# EAGLE design Bidirectional_Amp (EAGLE 9.3.0)

## Sheet 1 of 7: WiFi Adapter Interface and TX/RX Control
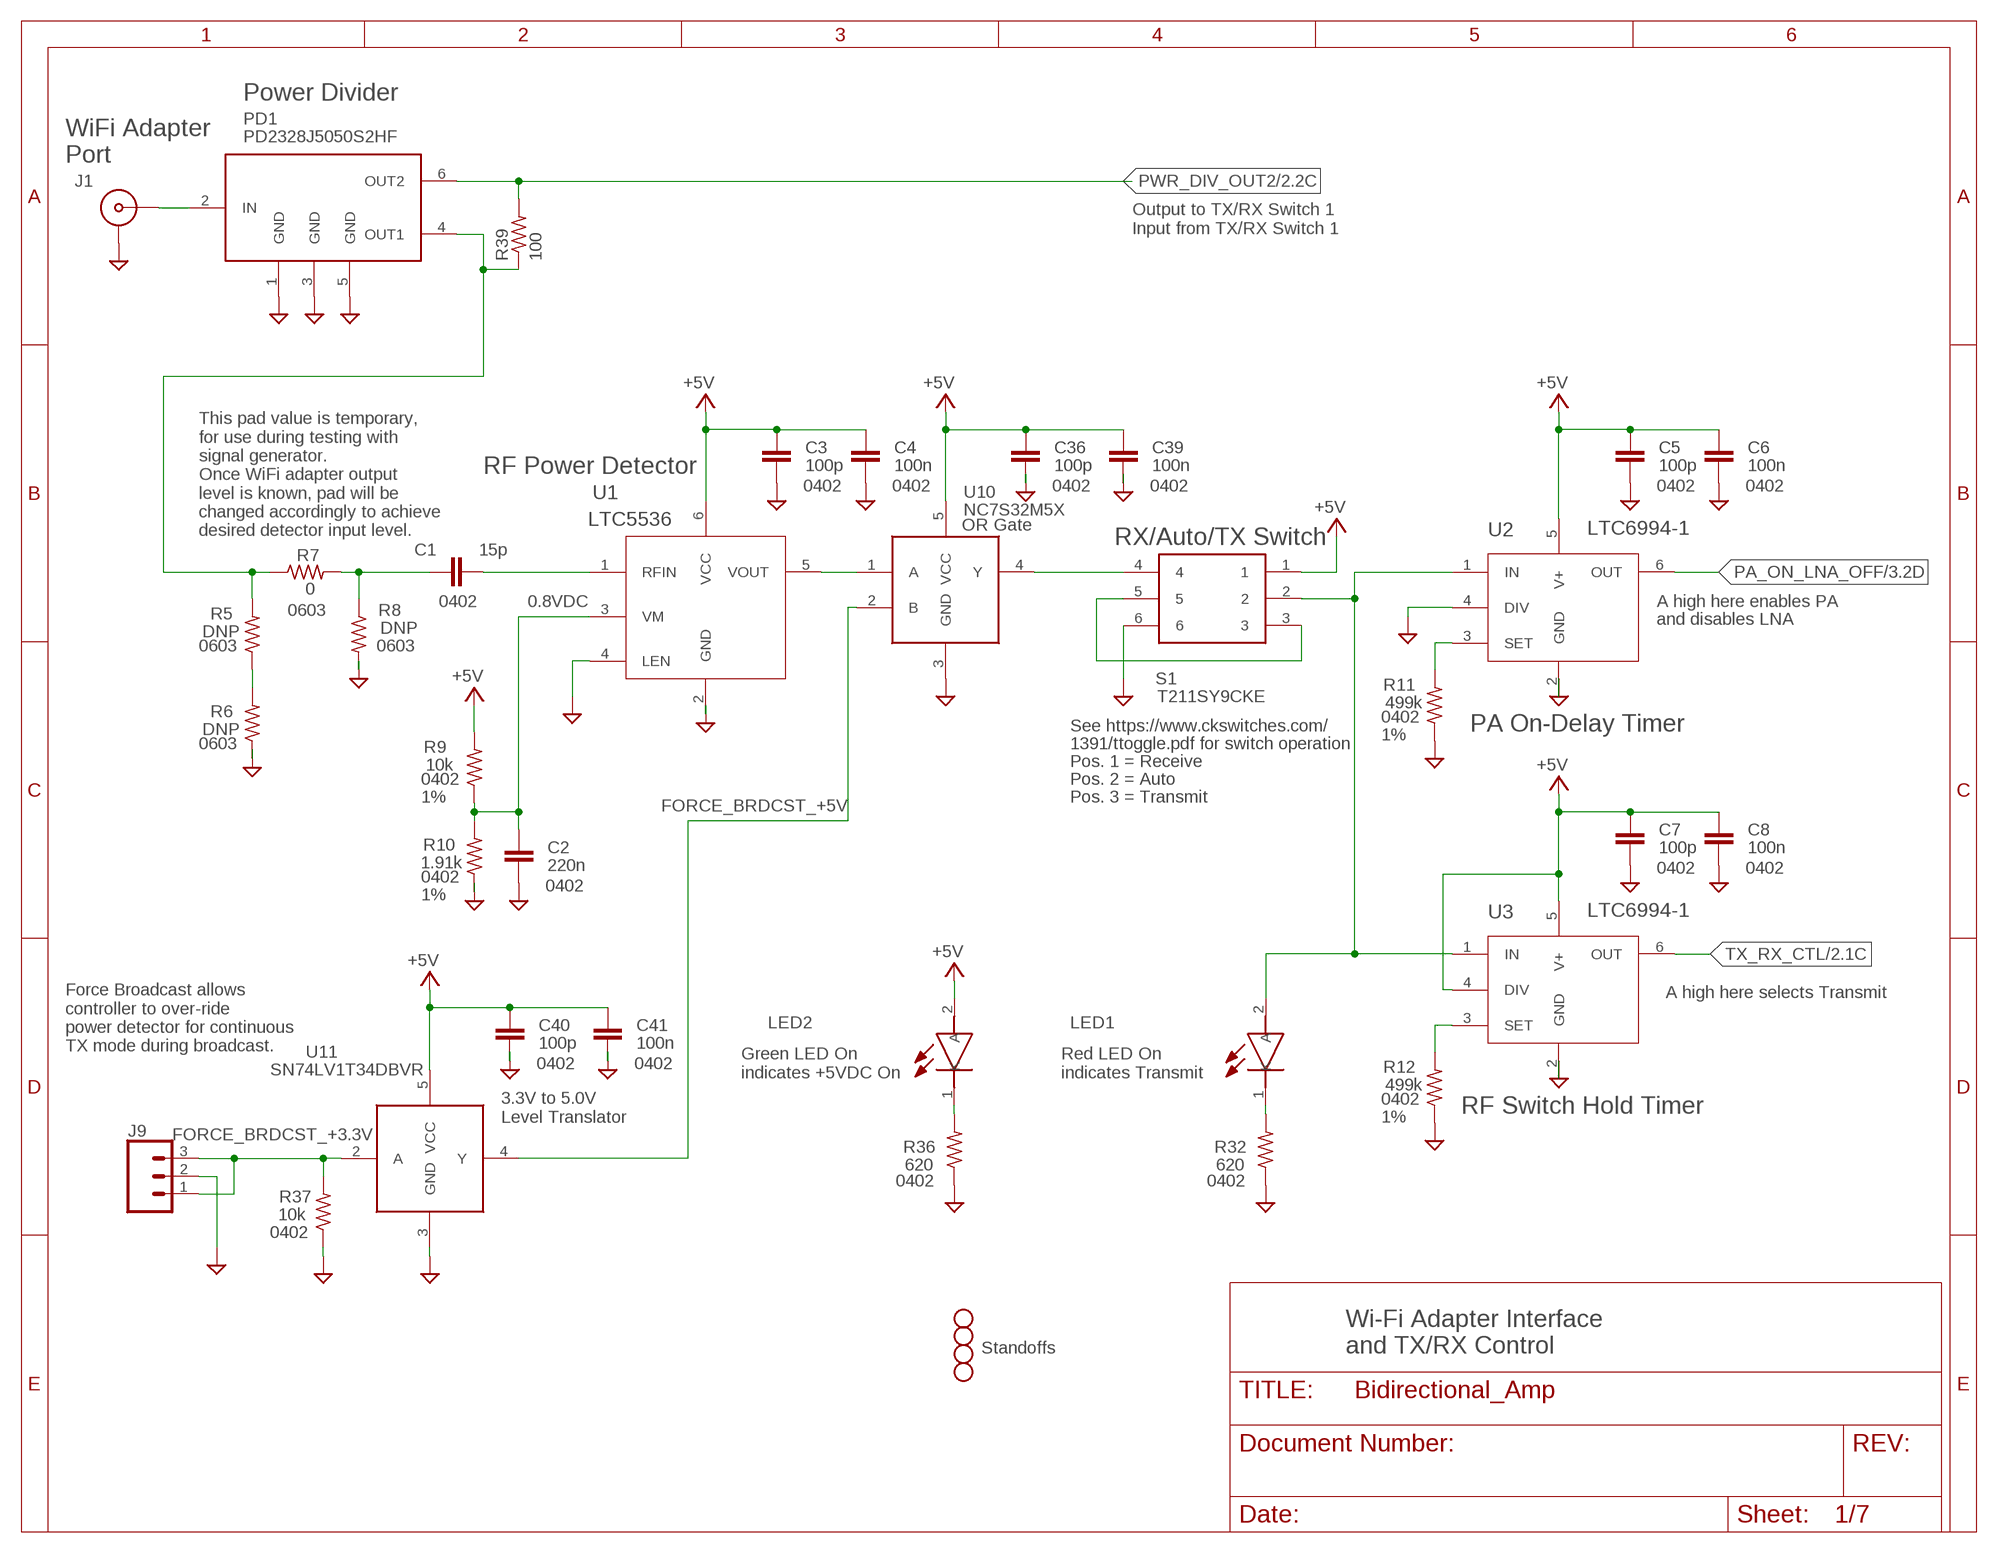
[diagram p0: schematic, sheet 1]

### Parts
C1  15p  C-EU0402-B-NOSILK  [.0402-B-NOSILK]
C2  220n  C-EU0402-B-NOSILK  [.0402-B-NOSILK]
C3  100p  C-EU0402-B-NOSILK  [.0402-B-NOSILK]
C4  100n  C-EU0402-B-NOSILK  [.0402-B-NOSILK]
C5  100p  C-EU0402-B-NOSILK  [.0402-B-NOSILK]
C6  100n  C-EU0402-B-NOSILK  [.0402-B-NOSILK]
C7  100p  C-EU0402-B-NOSILK  [.0402-B-NOSILK]
C8  100n  C-EU0402-B-NOSILK  [.0402-B-NOSILK]
C36  100p  C-EU0402-B-NOSILK  [.0402-B-NOSILK]
C39  100n  C-EU0402-B-NOSILK  [.0402-B-NOSILK]
C40  100p  C-EU0402-B-NOSILK  [.0402-B-NOSILK]
C41  100n  C-EU0402-B-NOSILK  [.0402-B-NOSILK]
H1  STAND-OFFTIGHT  [STAND-OFF-TIGHT]
H2  STAND-OFFTIGHT  [STAND-OFF-TIGHT]
H3  STAND-OFFTIGHT  [STAND-OFF-TIGHT]
H4  STAND-OFFTIGHT  [STAND-OFF-TIGHT]
J1  73415-2061  [73415-2063]
J9  CONN_03LONGPADS  [1X03_LONGPADS]
LED1  LTST-C193KRKT-5A  [LEDC1607X80N]
LED2  LTST-C193KGKT-5A  [LEDC1607X80N]
PD1  PD2328J5050S2HF  [PSON65P204X129X58-6N]
R5  DNP  R-US_R0603  [R0603]
R6  DNP  R-US_R0603  [R0603]
R7  0  R-US_R0603  [R0603]
R8  DNP  R-US_R0603  [R0603]
R9  10k  R-US_0402-B-NOSILK  [.0402-B-NOSILK]
R10  1.91k  R-US_0402-B-NOSILK  [.0402-B-NOSILK]
R11  499k  R-US_0402-B-NOSILK  [.0402-B-NOSILK]
R12  499k  R-US_0402-B-NOSILK  [.0402-B-NOSILK]
R32  620  R-US_0402-B-NOSILK  [.0402-B-NOSILK]
R36  620  R-US_0402-B-NOSILK  [.0402-B-NOSILK]
R37  10k  R-US_0402-B-NOSILK  [.0402-B-NOSILK]
R39  100  R-US_0603-C-NOSILK  [.0603-C-NOSILK]
S1  T211SY9CKE  T201MH9V3BE  [T201MH9V3BE]
U1  LTC5536  LTC5536ES6TRMPBF  [TSOT-23_S6]
U2  LTC6994-1  LTC6994CS6-1PBF  [TSOT-23_S6]
U3  LTC6994-1  LTC6994CS6-1PBF  [TSOT-23_S6]
U10  NC7S32M5X  [SOT95P280X145-5N]
U11  SN74LV1T34DBVR  [SOT95P280X145-5N]

### Nets
+5V: C3.1 C4.1 C5.1 C6.1 C7.1 C8.1 C36.1 C39.1 C40.1 C41.1 LED2.2(A) R9.2 S1.1 U1.6(VCC) U2.5(V+) U3.4(DIV) U3.5(V+) U10.5(VCC) U11.5(VCC) ; also sheet 2,3,4,5,6
FORCE_BRDCST_+3.3V: J9.1 J9.3 R37.2 U11.2(A)
FORCE_BRDCST_+5V: U10.2(B) U11.4(Y)
GND: C2.2 C3.2 C4.2 C5.2 C6.2 C7.2 C8.2 C36.2 C39.2 C40.2 C41.2 J1.2(GND) J1.3(GND) J1.4(GND) J1.5(GND) J9.2 PD1.1(GND) PD1.3(GND) PD1.5(GND) R6.1 R8.2 R10.1 R11.1 R12.1 R32.1 R36.1 R37.1 S1.6 U1.2(GND) U1.4(LEN) U2.2(GND) U2.4(DIV) U3.2(GND) U10.3(GND) U11.3(GND) ; also sheet 2,3,4,5,6,7
N$1 [RF]: J1.1(CTR) PD1.2(IN)
N$3: U1.5(VOUT) U10.1(A)
N$5 [RF]: PD1.4(OUT1) R5.2 R7.1 R39.1
N$6 [RF]: C1.1 R7.2 R8.1
N$7: R5.1 R6.2
N$8 [RF]: C1.2 U1.1(RFIN)
N$9: C2.1 R9.1 R10.2 U1.3(VM)
N$10: LED1.2(A) S1.2 U2.1(IN) U3.1(IN)
N$11: R11.2 U2.3(SET)
N$12: S1.3 S1.5
N$14: R12.2 U3.3(SET)
N$15: LED1.1(K) R32.2
N$51: LED2.1(K) R36.2
N$52: S1.4 U10.4(Y)
PA_ON_LNA_OFF: U2.6(OUT) ; also sheet 3,4
PWR_DIV_OUT2 [RF]: PD1.6(OUT2) R39.2 ; also sheet 2
TX_RX_CTL: U3.6(OUT) ; also sheet 2,5

### Notes on the sheet
- Power Divider
- WiFi Adapter
  Port
- Output to TX/RX Switch 1
  Input from TX/RX Switch 1
- RF Power Detector
- 0402 | 0402 | 0402 | 0402 | 0402 | 0402
- OR Gate
- This pad value is temporary,
  for use during testing with
  signal generator.
  Once WiFi adapter output
  level is known, pad will be
  changed accordingly to achieve
  desired detector input level.
- RX/Auto/TX Switch
- 0402 | 0.8VDC | A high here enables PA
- 0603
- and disables LNA
- 0603 | 0603
- 0402
- See https://www.ckswitches.com/ | PA On-Delay Timer
- 1%
- 0603 | 1391/ttoggle.pdf for switch operation
- Pos. 1 = Receive
- 0402 | Pos. 2 = Auto
- 1% | Pos. 3 = Transmit
- 0402 | 0402
- 0402
- 0402
- 1%
- A high here selects Transmit
- Force Broadcast allows
  controller to over-ride
  power detector for continuous
  TX mode during broadcast.
- 0402 | 0402
- Green LED On
  indicates +5VDC On
- Red LED On
  indicates Transmit
- 0402
- RF Switch Hold Timer
- 3.3V to 5.0V
  Level Translator
- 1%
- 0402 | 0402
- 0402
- Standoffs
- Wi-Fi Adapter Interface
  and TX/RX Control

## Sheet 2 of 7: TX/RX Switching, WiFi Adapter Side
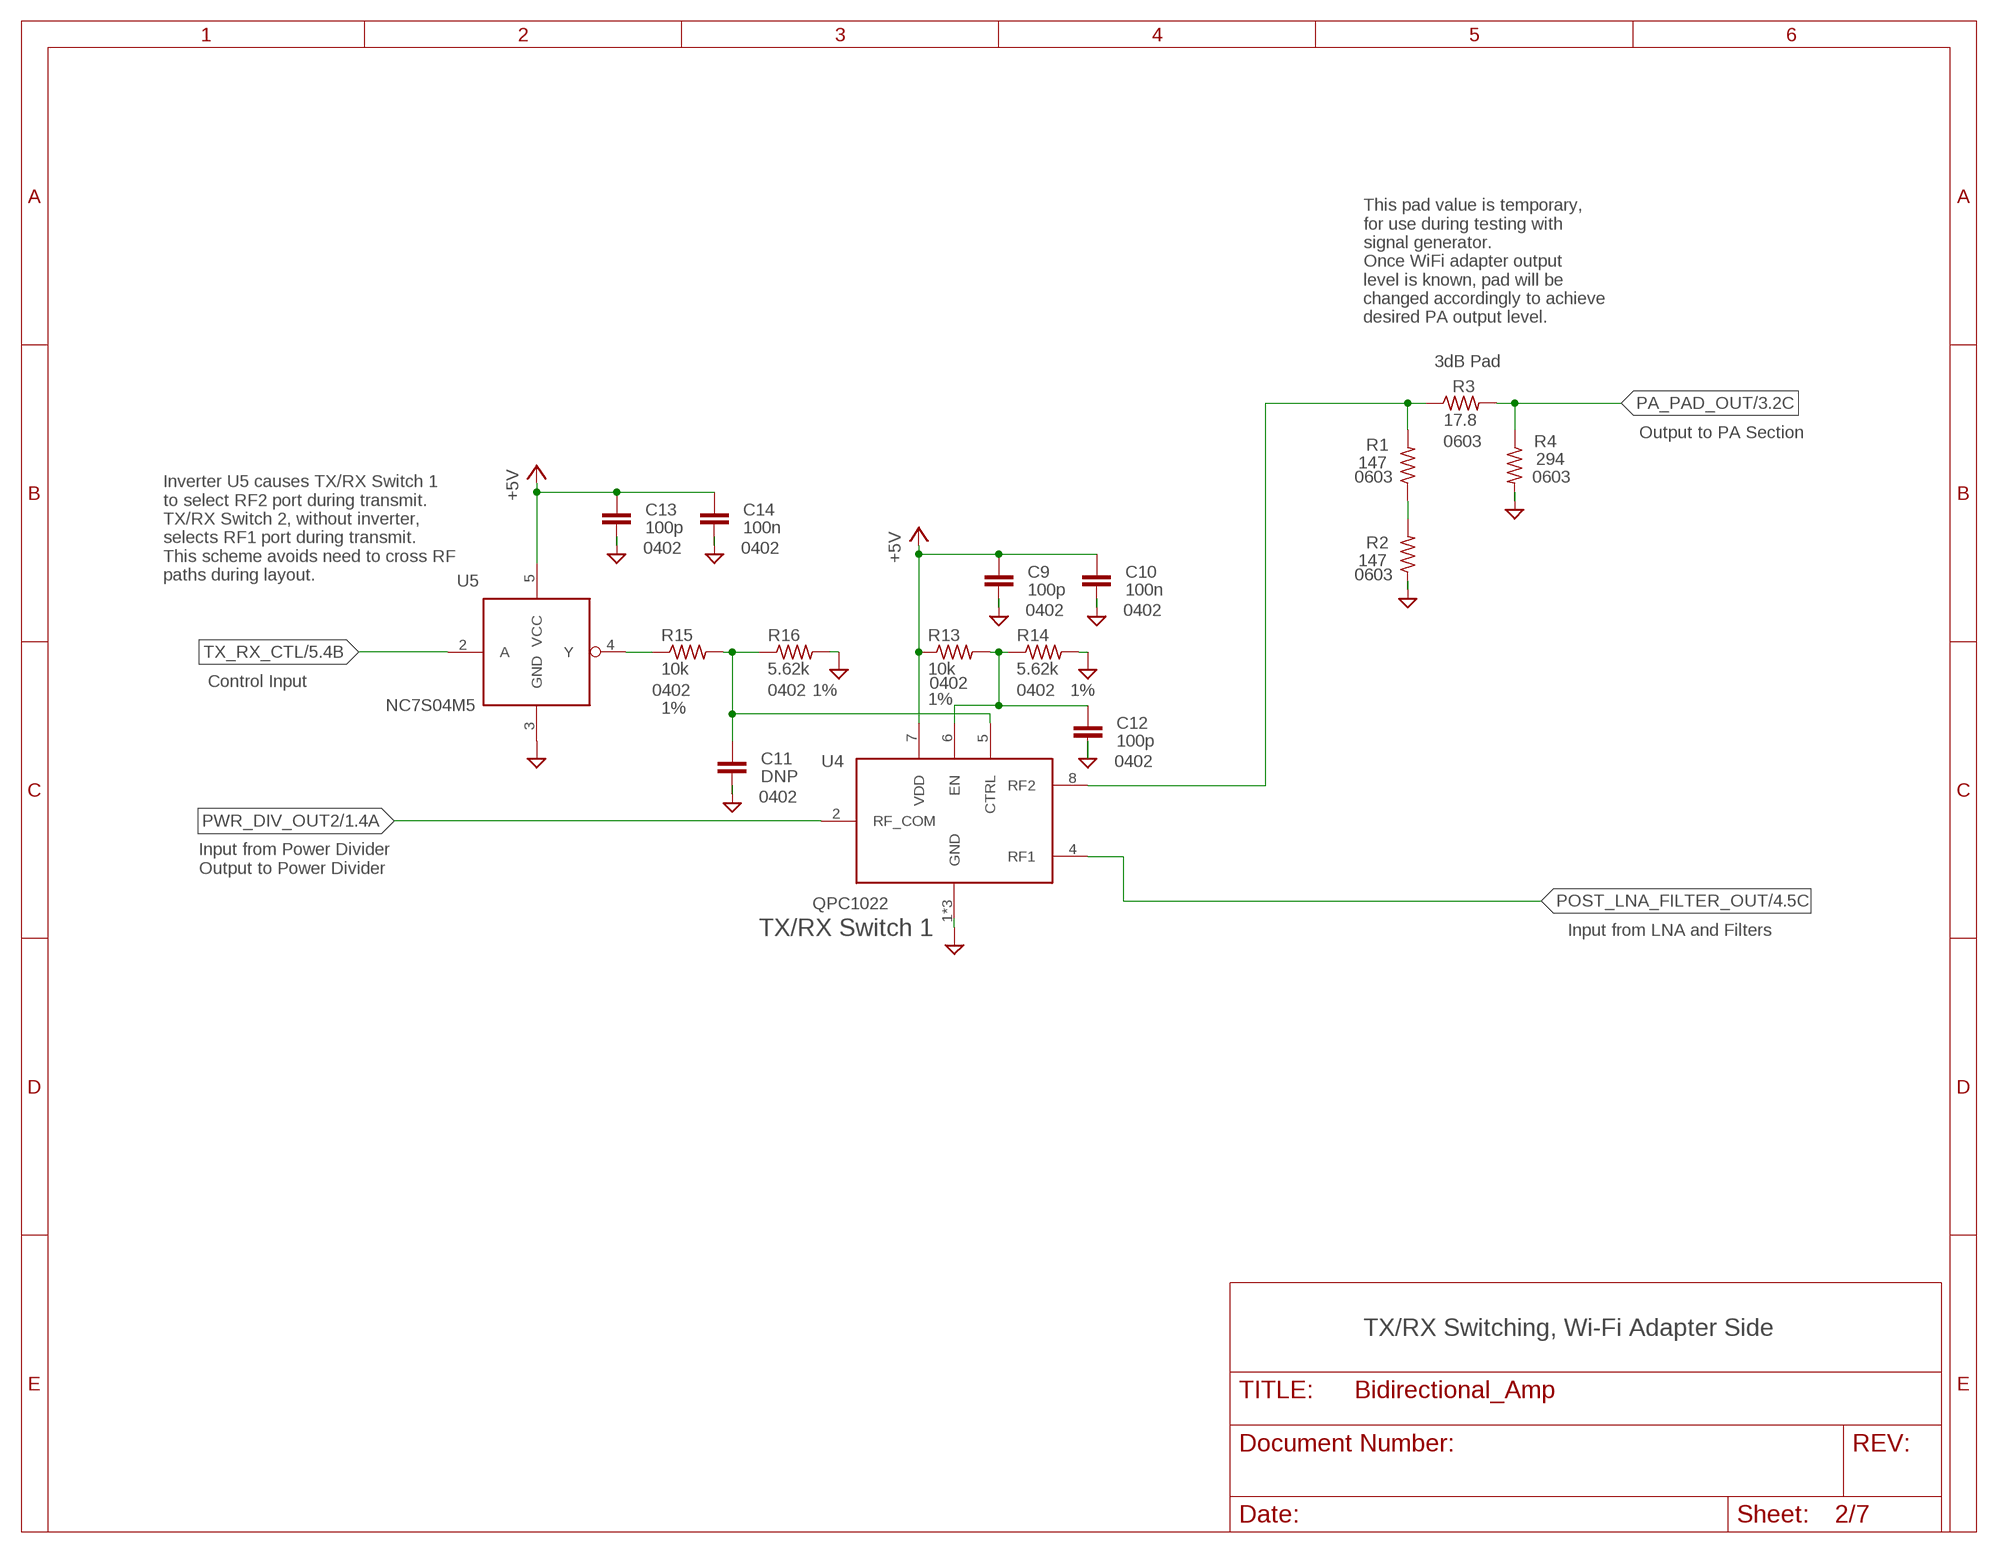
[diagram p1: schematic, sheet 2]

### Parts
C9  100p  C-EU0402-B-NOSILK  [.0402-B-NOSILK]
C10  100n  C-EU0402-B-NOSILK  [.0402-B-NOSILK]
C11  DNP  C-EU0402-B-NOSILK  [.0402-B-NOSILK]
C12  100p  C-EU0402-B-NOSILK  [.0402-B-NOSILK]
C13  100p  C-EU0402-B-NOSILK  [.0402-B-NOSILK]
C14  100n  C-EU0402-B-NOSILK  [.0402-B-NOSILK]
R1  147  R-US_R0603  [R0603]
R2  147  R-US_R0603  [R0603]
R3  17.8  R-US_R0603  [R0603]
R4  294  R-US_R0603  [R0603]
R13  10k  R-US_0402-B-NOSILK  [.0402-B-NOSILK]
R14  5.62k  R-US_0402-B-NOSILK  [.0402-B-NOSILK]
R15  10k  R-US_0402-B-NOSILK  [.0402-B-NOSILK]
R16  5.62k  R-US_0402-B-NOSILK  [.0402-B-NOSILK]
U4  QPC1022  [QPC1022]
U5  NC7S04M5  NC7S04M5XX  [SOT95P280X140-5N]

### Nets
+5V: C9.1 C10.1 C13.1 C14.1 R13.1 U4.7(VDD) U5.5(VCC) ; also sheet 1,3,4,5,6
GND: C9.2 C10.2 C11.2 C12.2 C13.2 C14.2 R2.1 R4.2 R14.2 R16.2 U4.1(GND) U4.3(GND) U4.9(GND) U5.3(GND) ; also sheet 1,3,4,5,6,7
N$2 [RF]: R1.2 R3.1 U4.8(RF2)
N$4: R1.1 R2.2
N$13: C12.1 R13.2 R14.1 U4.6(EN)
N$17: C11.1 R15.2 R16.1 U4.5(CTRL)
N$18: R15.1 U5.4(Y)
PA_PAD_OUT [RF]: R3.2 R4.1 ; also sheet 3
POST_LNA_FILTER_OUT [RF]: U4.4(RF1) ; also sheet 4
PWR_DIV_OUT2 [RF]: U4.2(RF_COM) ; also sheet 1
TX_RX_CTL: U5.2(A) ; also sheet 1,5

### Notes on the sheet
- This pad value is temporary,
  for use during testing with
  signal generator.
  Once WiFi adapter output
  level is known, pad will be
  changed accordingly to achieve
  desired PA output level.
- 3dB Pad
- Output to PA Section
- 0603
- 0603 | 0603
- 0402 | 0402
- Inverter U5 causes TX/RX Switch 1
  to select RF2 port during transmit.
  TX/RX Switch 2, without inverter,
  selects RF1 port during transmit.
  This scheme avoids need to cross RF
  paths during layout.
- 0603
- 0402 | 0402
- Control Input | 0402
- 0402 | 0402 | 1% | 0402 | 1%
- 1%
- 1%
- 0402
- 0402
- Input from Power Divider
  Output to Power Divider
- TX/RX Switch 1 | Input from LNA and Filters
- TX/RX Switching, Wi-Fi Adapter Side

## Sheet 3 of 7: Power Amplifier
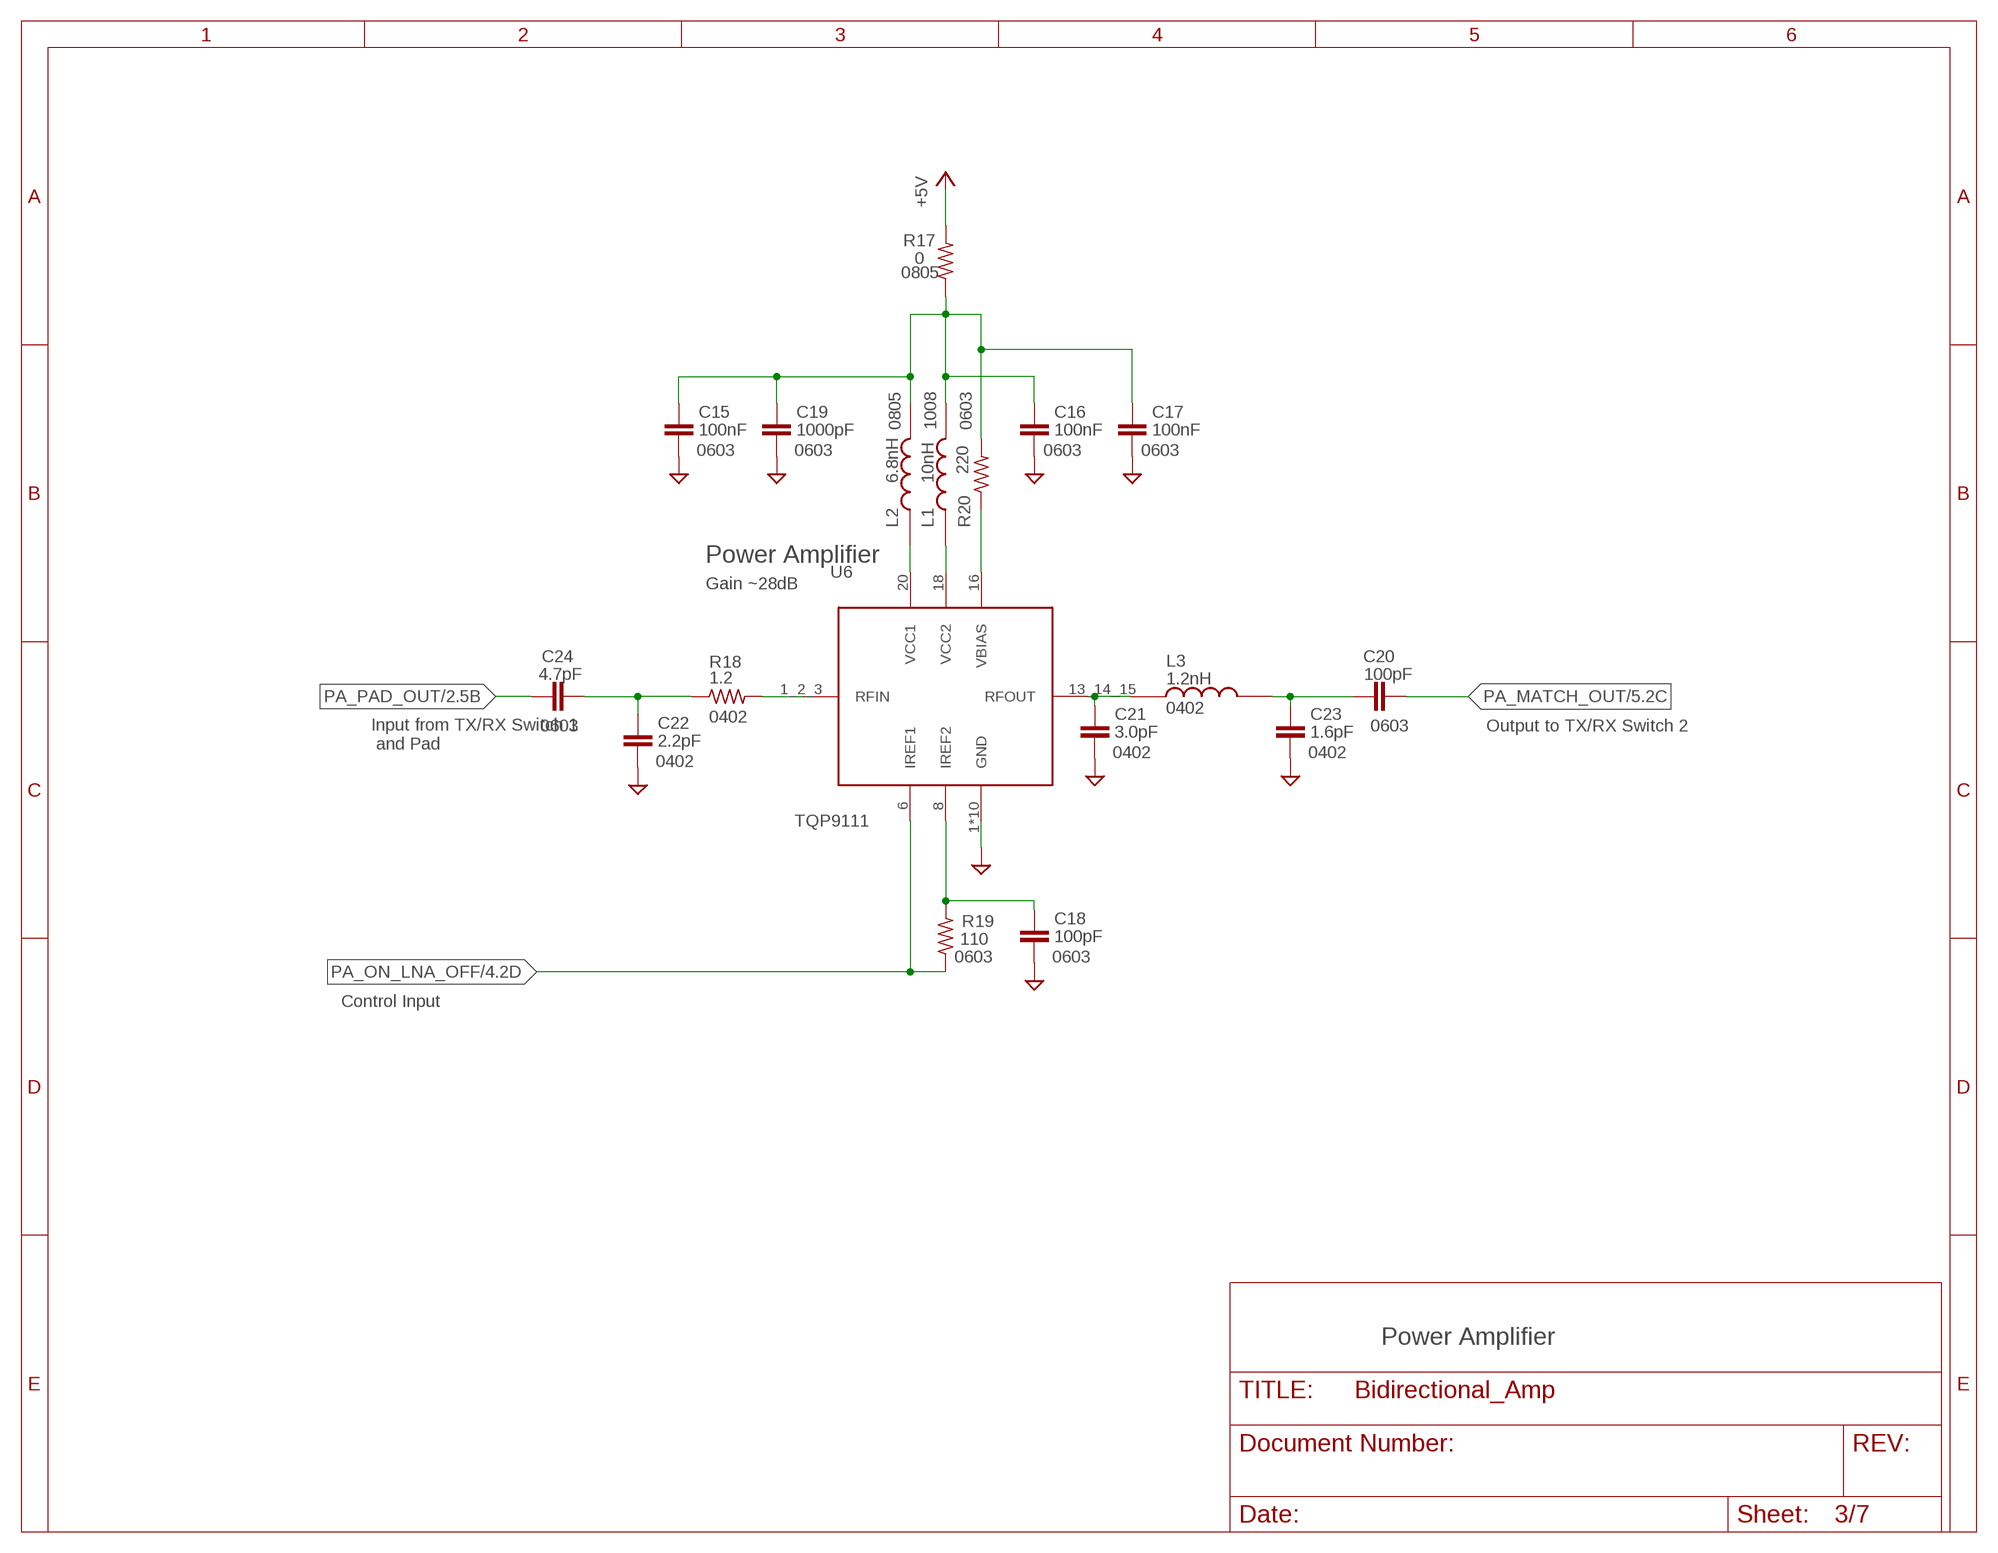
[diagram p2: schematic, sheet 3]

### Parts
C15  100nF  C-EUC0603  [C0603]
C16  100nF  C-EUC0603  [C0603]
C17  100nF  C-EUC0603  [C0603]
C18  100pF  C-EUC0603  [C0603]
C19  1000pF  C-EUC0603  [C0603]
C20  100pF  C-EUC0603  [C0603]
C21  3.0pF  C-EUC0402  [C0402]
C22  2.2pF  C-EUC0402  [C0402]
C23  1.6pF  C-EUC0402  [C0402]
C24  4.7pF  C-EUC0603  [C0603]
L1  10nH  1008HQ-10NXJLB  [INDC2928X203N]
L2  6.8nH  0805CS-060XJLC  [0805CS]
L3  1.2nH  0402CS-1N2XJLW  [0402CS1N2XJLW]
R17  0  R-US_R0805  [R0805]
R18  1.2  R-US_R0402  [R0402]
R19  110  R-US_R0603  [R0603]
R20  220  R-US_R0603  [R0603]
U6  TQP9111  [SAMACSYS_PARTS_QFN50P400X400X102-21N]

### Nets
+5V: R17.2 ; also sheet 1,2,4,5,6
GND: C15.2 C16.2 C17.2 C18.2 C19.2 C21.2 C22.2 C23.2 U6.1(GND) U6.5(GND) U6.7(GND) U6.9(GND) U6.10(GND) U6.11(GND) U6.15(GND) U6.17(GND) U6.19(GND) U6.21(GND) ; also sheet 1,2,4,5,6,7
N$16: R20.1 U6.16(VBIAS)
N$19: L1.1 U6.18(VCC2)
N$20: L2.1 U6.20(VCC1)
N$21: C15.1 C16.1 C17.1 C19.1 L1.2 L2.2 R17.1 R20.2
N$22: C18.1 R19.2 U6.8(IREF2)
N$24 [RF]: C21.1 L3.1 U6.13_14_15(RFOUT)
N$25 [RF]: C22.1 C24.2 R18.1
N$27 [RF]: C20.1 C23.1 L3.2
N$56 [RF]: R18.2 U6.1_2_3(RFIN)
PA_MATCH_OUT [RF]: C20.2 ; also sheet 5
PA_ON_LNA_OFF: R19.1 U6.6(IREF1) ; also sheet 1,4
PA_PAD_OUT [RF]: C24.1 ; also sheet 2

### Notes on the sheet
- 0805
- 0805 | 1008 | 0603
- 0603 | 0603 | 0603 | 0603
- Power Amplifier
- Gain ~28dB
- 0402
- 0402
- 0603 | 0603 | Output to TX/RX Switch 2
- Input from TX/RX Switch 1
   and Pad
- 0402 | 0402
- 0402
- 0603 | 0603
- Control Input
- Power Amplifier

## Sheet 4 of 7: LNA and RX Bandpass Filters
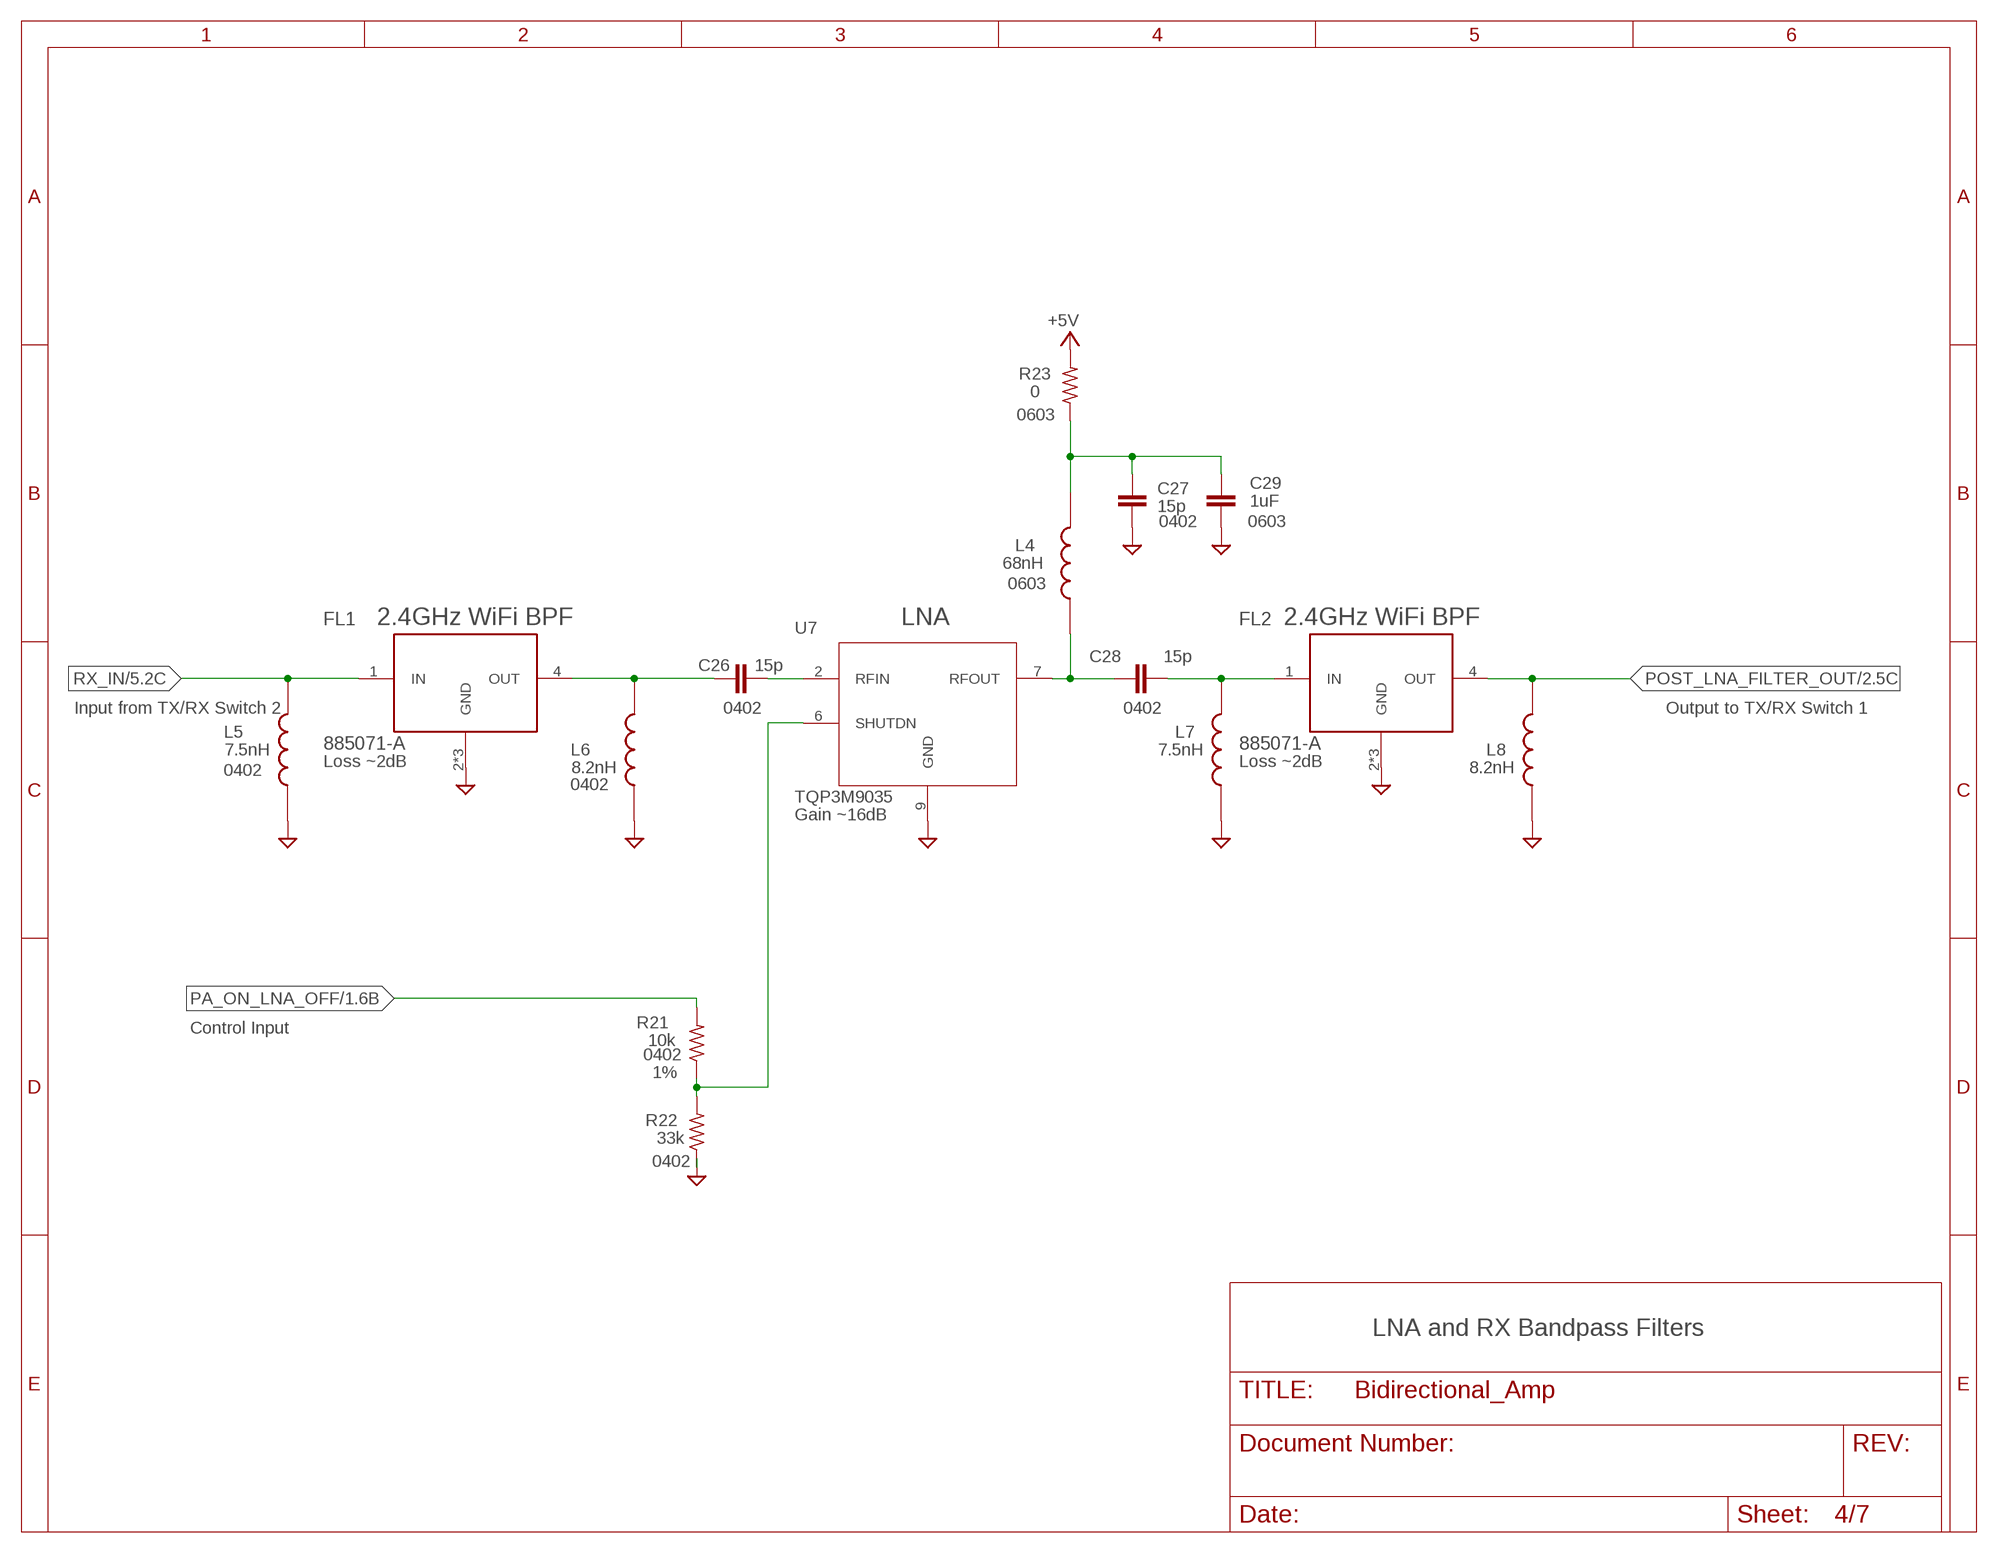
[diagram p3: schematic, sheet 4]

### Parts
C26  15p  C-EUC0402  [C0402]
C27  15p  C-EU0402-B-NOSILK  [.0402-B-NOSILK]
C28  15p  C-EUC0402  [C0402]
C29  1uF  C-EUC0603  [C0603]
FL1  885071-A  [FIL_B39162B9417K610]
FL2  885071-A  [FIL_B39162B9417K610]
L4  68nH  0603CS-68NXJLW  [0603CS-68NXJLW]
L5  7.5nH  0402CS-1N2XJLW  [0402CS1N2XJLW]
L6  8.2nH  0402CS-1N2XJLW  [0402CS1N2XJLW]
L7  7.5nH  0402CS-1N2XJLW  [0402CS1N2XJLW]
L8  8.2nH  0402CS-1N2XJLW  [0402CS1N2XJLW]
R21  10k  R-US_0402-B-NOSILK  [.0402-B-NOSILK]
R22  33k  R-US_0402-B-NOSILK  [.0402-B-NOSILK]
R23  0  R-US_R0603  [R0603]
U7  TQP3M9035  [DFN-8]

### Nets
+5V: R23.2 ; also sheet 1,2,3,5,6
GND: C27.1 C29.2 FL1.2(GND) FL1.3(GND) FL1.5(GND) FL2.2(GND) FL2.3(GND) FL2.5(GND) L5.1 L6.1 L7.1 L8.1 R22.1 U7.9(GND) ; also sheet 1,2,3,5,6,7
N$26 [RF]: C26.2 U7.2(RFIN)
N$28 [RF]: C28.1 L4.1 U7.7(RFOUT)
N$29: C27.2 C29.1 L4.2 R23.1
N$30: R21.1 R22.2 U7.6(SHUTDN)
N$33 [RF]: C26.1 FL1.4(OUT) L6.2
N$35 [RF]: C28.2 FL2.1(IN) L7.2
PA_ON_LNA_OFF: R21.2 ; also sheet 1,3
POST_LNA_FILTER_OUT [RF]: FL2.4(OUT) L8.2 ; also sheet 2
RX_IN [RF]: FL1.1(IN) L5.2 ; also sheet 5

### Notes on the sheet
- 0603
- 0402 | 0603
- 0603
- 2.4GHz WiFi BPF | LNA | 2.4GHz WiFi BPF
- Input from TX/RX Switch 2 | 0402 | 0402 | Output to TX/RX Switch 1
- Loss ~2dB | Loss ~2dB
- 0402
- 0402
- Gain ~16dB
- Control Input
- 0402
- 1%
- 0402
- LNA and RX Bandpass Filters

## Sheet 5 of 7: TX/RX Switching, Antenna Side
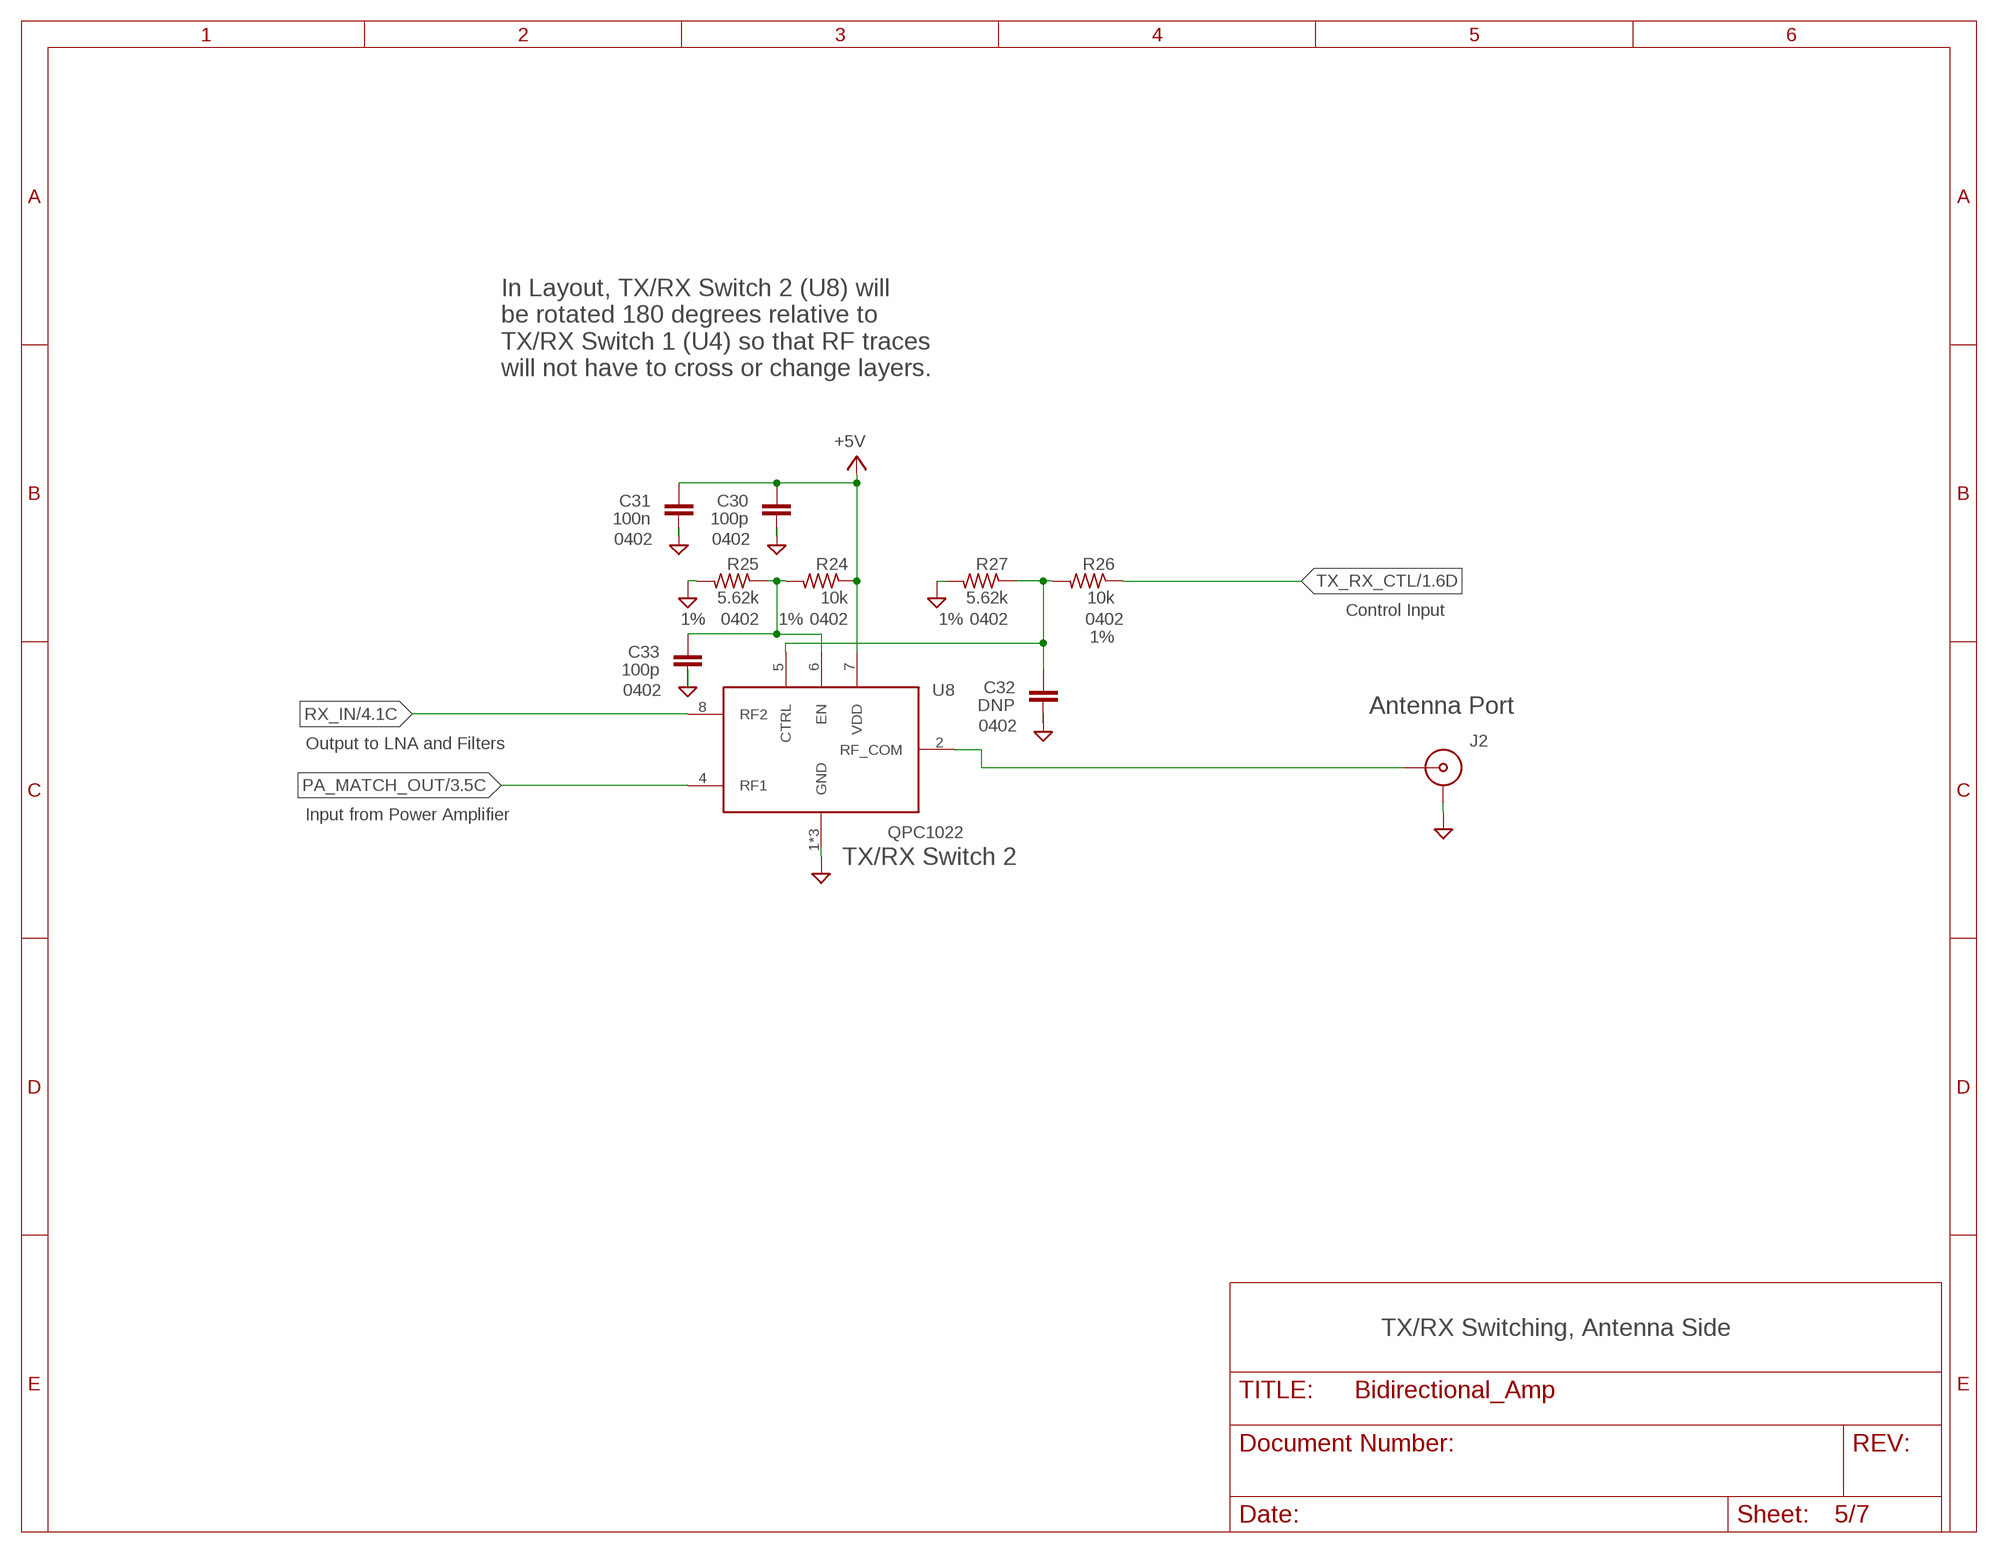
[diagram p4: schematic, sheet 5]

### Parts
C30  100p  C-EU0402-B-NOSILK  [.0402-B-NOSILK]
C31  100n  C-EU0402-B-NOSILK  [.0402-B-NOSILK]
C32  DNP  C-EU0402-B-NOSILK  [.0402-B-NOSILK]
C33  100p  C-EU0402-B-NOSILK  [.0402-B-NOSILK]
J2  73415-2061  [73415-2063]
R24  10k  R-US_0402-B-NOSILK  [.0402-B-NOSILK]
R25  5.62k  R-US_0402-B-NOSILK  [.0402-B-NOSILK]
R26  10k  R-US_0402-B-NOSILK  [.0402-B-NOSILK]
R27  5.62k  R-US_0402-B-NOSILK  [.0402-B-NOSILK]
U8  QPC1022  [QPC1022]

### Nets
+5V: C30.1 C31.1 R24.1 U8.7(VDD) ; also sheet 1,2,3,4,6
GND: C30.2 C31.2 C32.2 C33.2 J2.2(GND) J2.3(GND) J2.4(GND) J2.5(GND) R25.2 R27.2 U8.1(GND) U8.3(GND) U8.9(GND) ; also sheet 1,2,3,4,6,7
N$31 [RF]: J2.1(CTR) U8.2(RF_COM)
N$32: C33.1 R24.2 R25.1 U8.6(EN)
N$34: C32.1 R26.2 R27.1 U8.5(CTRL)
PA_MATCH_OUT [RF]: U8.4(RF1) ; also sheet 3
RX_IN [RF]: U8.8(RF2) ; also sheet 4
TX_RX_CTL: R26.1 ; also sheet 1,2

### Notes on the sheet
- In Layout, TX/RX Switch 2 (U8) will
  be rotated 180 degrees relative to
  TX/RX Switch 1 (U4) so that RF traces
  will not have to cross or change layers.
- 0402 | 0402
- Control Input
- 1% | 0402 | 1% | 0402 | 1% | 0402 | 0402
- 1%
- 0402
- Antenna Port
- 0402
- Output to LNA and Filters
- Input from Power Amplifier
- TX/RX Switch 2
- TX/RX Switching, Antenna Side

## Sheet 6 of 7: +5V Step-Up DC/DC Converter
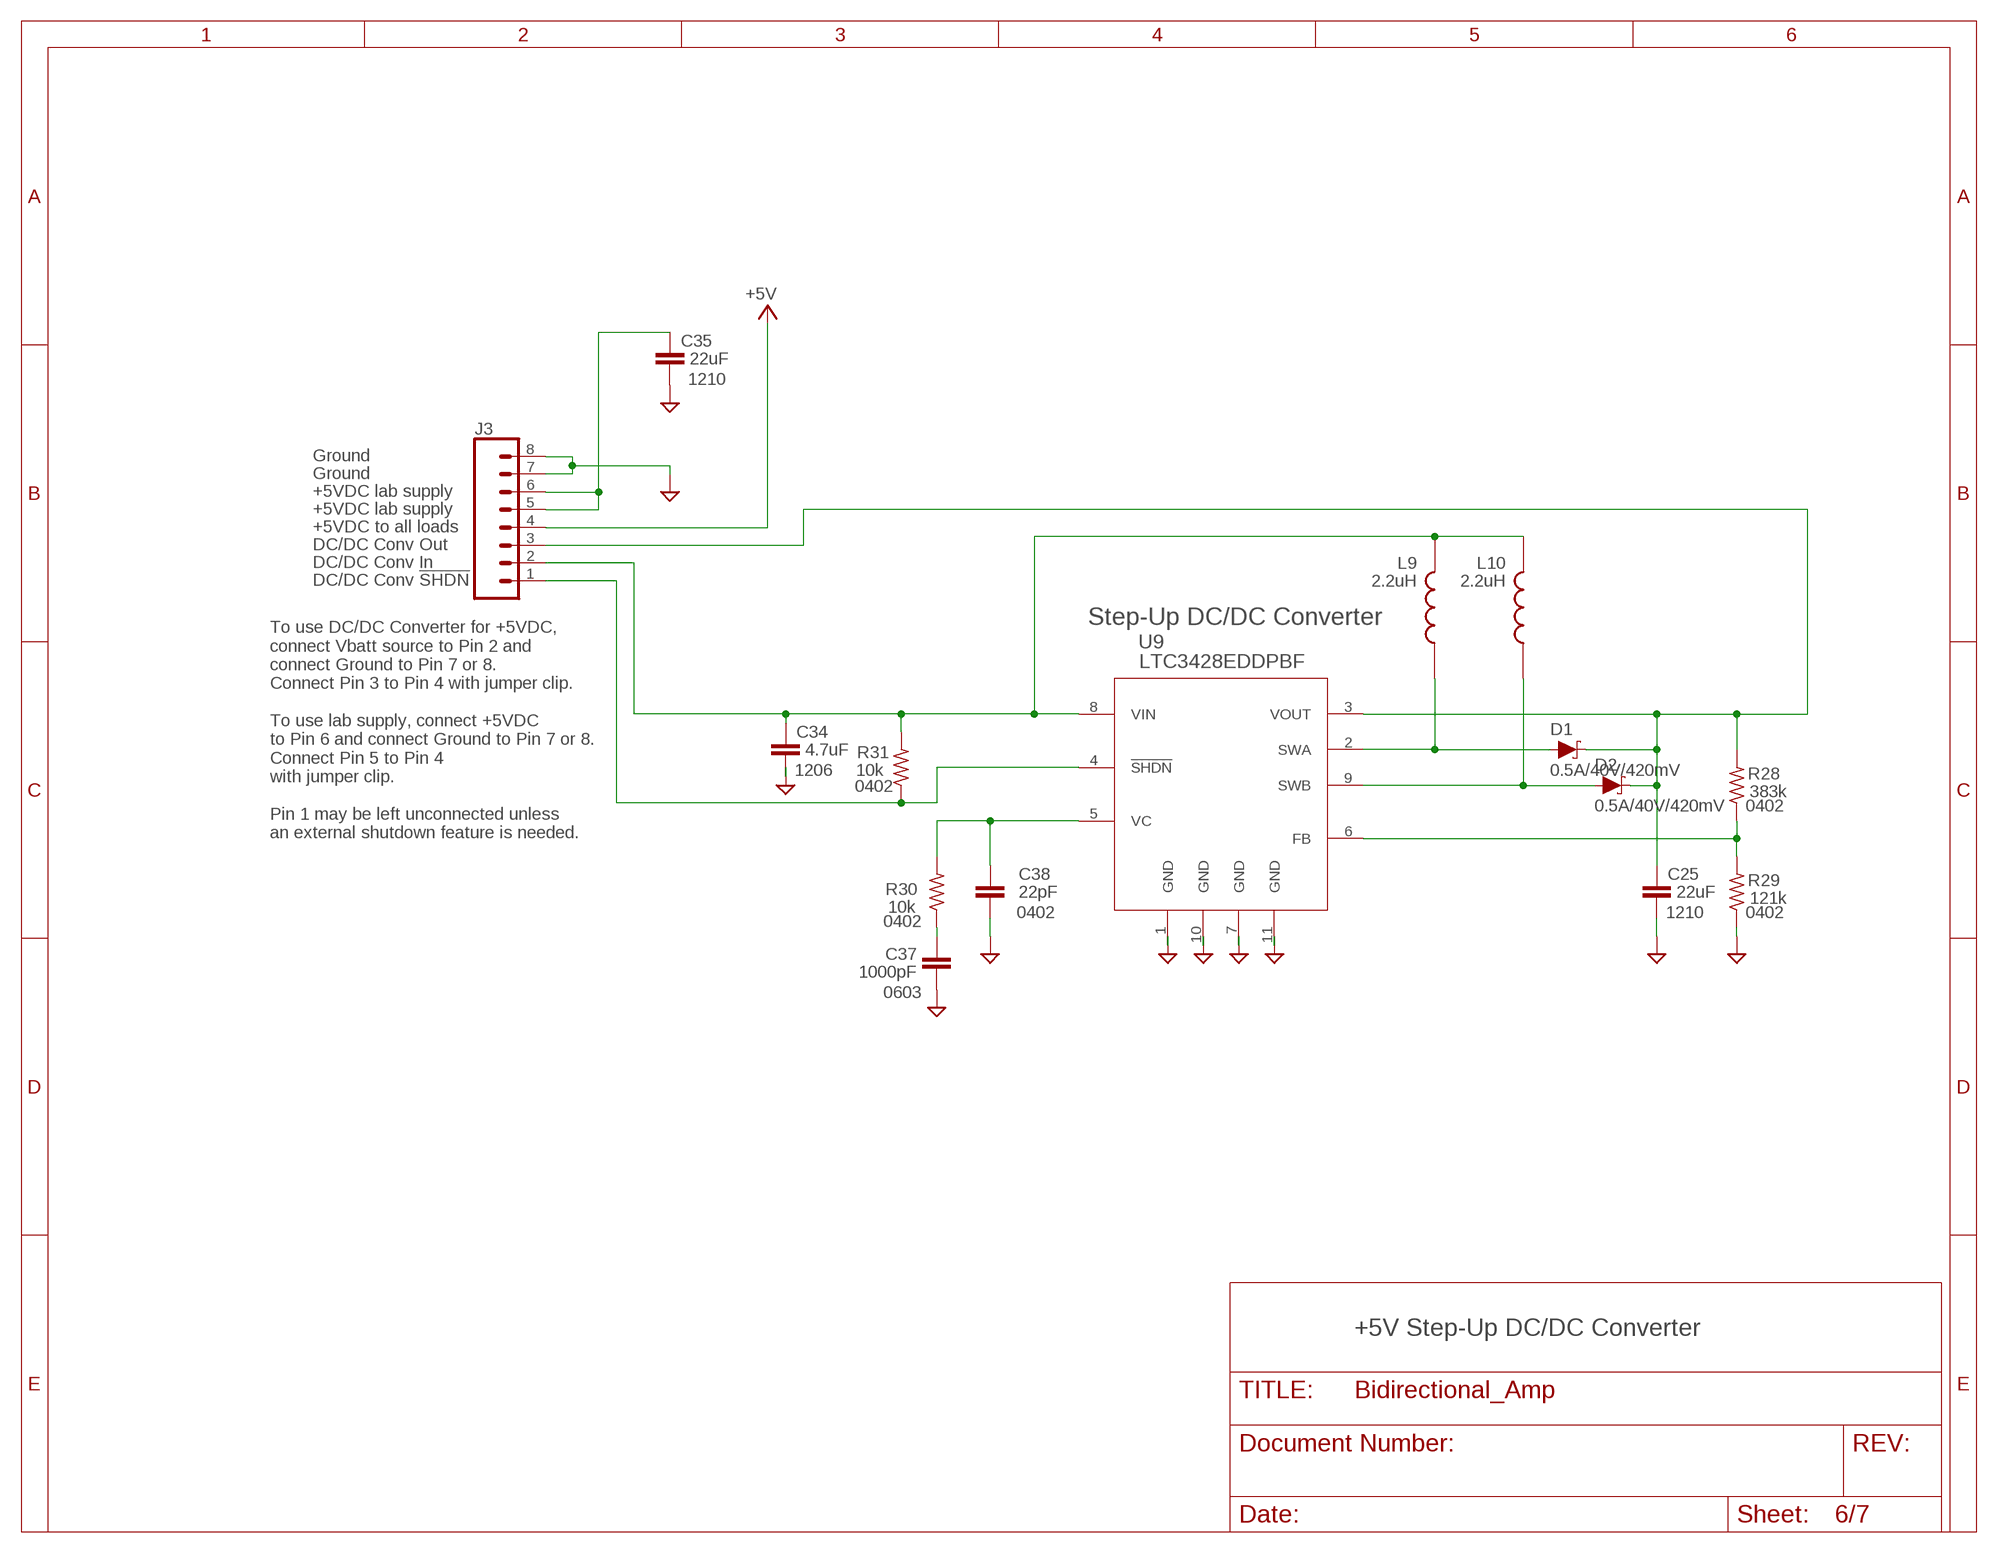
[diagram p5: schematic, sheet 6]

### Parts
C25  22uF  C-EUC1210  [C1210]
C34  4.7uF  C-EUC1206  [C1206]
C35  22uF  C-EUC1210  [C1210]
C37  1000pF  C-EUC0603  [C0603]
C38  22pF  C-EU0402-B-NOSILK  [.0402-B-NOSILK]
D1  0.5A/40V/420mV  DIODE-SCHOTTKY-PMEG4005EJ  [SOD-323]
D2  0.5A/40V/420mV  DIODE-SCHOTTKY-PMEG4005EJ  [SOD-323]
J3  CONN_08LONGPADS  [1X08_LONGPADS]
L9  2.2uH  XFL4020-222MEB  [XFL4020-222ME]
L10  2.2uH  XFL4020-222MEB  [XFL4020-222ME]
R28  383k  R-US_0402-B-NOSILK  [.0402-B-NOSILK]
R29  121k  R-US_0402-B-NOSILK  [.0402-B-NOSILK]
R30  10k  R-US_0402-B-NOSILK  [.0402-B-NOSILK]
R31  10k  R-US_0402-B-NOSILK  [.0402-B-NOSILK]
U9  LTC3428EDDPBF  [DFN-10_DD]

### Nets
+5V: J3.4 ; also sheet 1,2,3,4,5
FB1: R28.1 R29.2 U9.6(FB)
GND: C25.2 C34.2 C35.2 C37.2 C38.2 J3.7 J3.8 R29.1 U9.1(GND) U9.7(GND) U9.10(GND) U9.11(GND) ; also sheet 1,2,3,4,5,7
N$23: C37.1 R30.1
N$36: C35.1 J3.5 J3.6
SHDN1: J3.1 R31.1 U9.4(!SHDN)
SWA1: D1.A L9.1 U9.2(SWA)
SWB1: D2.A L10.1 U9.9(SWB)
VC1: C38.1 R30.2 U9.5(VC)
VIN1: C34.1 J3.2 L9.2 L10.2 R31.2 U9.8(VIN)
VOUT1: C25.1 D1.C D2.C J3.3 R28.2 U9.3(VOUT)

### Notes on the sheet
- 1210
- Ground
- Ground
- +5VDC lab supply
- +5VDC lab supply
- +5VDC to all loads
- DC/DC Conv Out
- DC/DC Conv In
- DC/DC Conv !SHDN!
- Step-Up DC/DC Converter
- 1206
- 0402
- 0402
- To use DC/DC Converter for +5VDC,
  connect Vbatt source to Pin 2 and
  connect Ground to Pin 7 or 8.
  Connect Pin 3 to Pin 4 with jumper clip.
  
  To use lab supply, connect +5VDC
  to Pin 6 and connect Ground to Pin 7 or 8.
  Connect Pin 5 to Pin 4
  with jumper clip.
  
  Pin 1 may be left unconnected unless
  an external shutdown feature is needed.
- 0402 | 1210 | 0402
- 0402
- 0603
- +5V Step-Up DC/DC Converter

## Sheet 7 of 7: Test Circuits
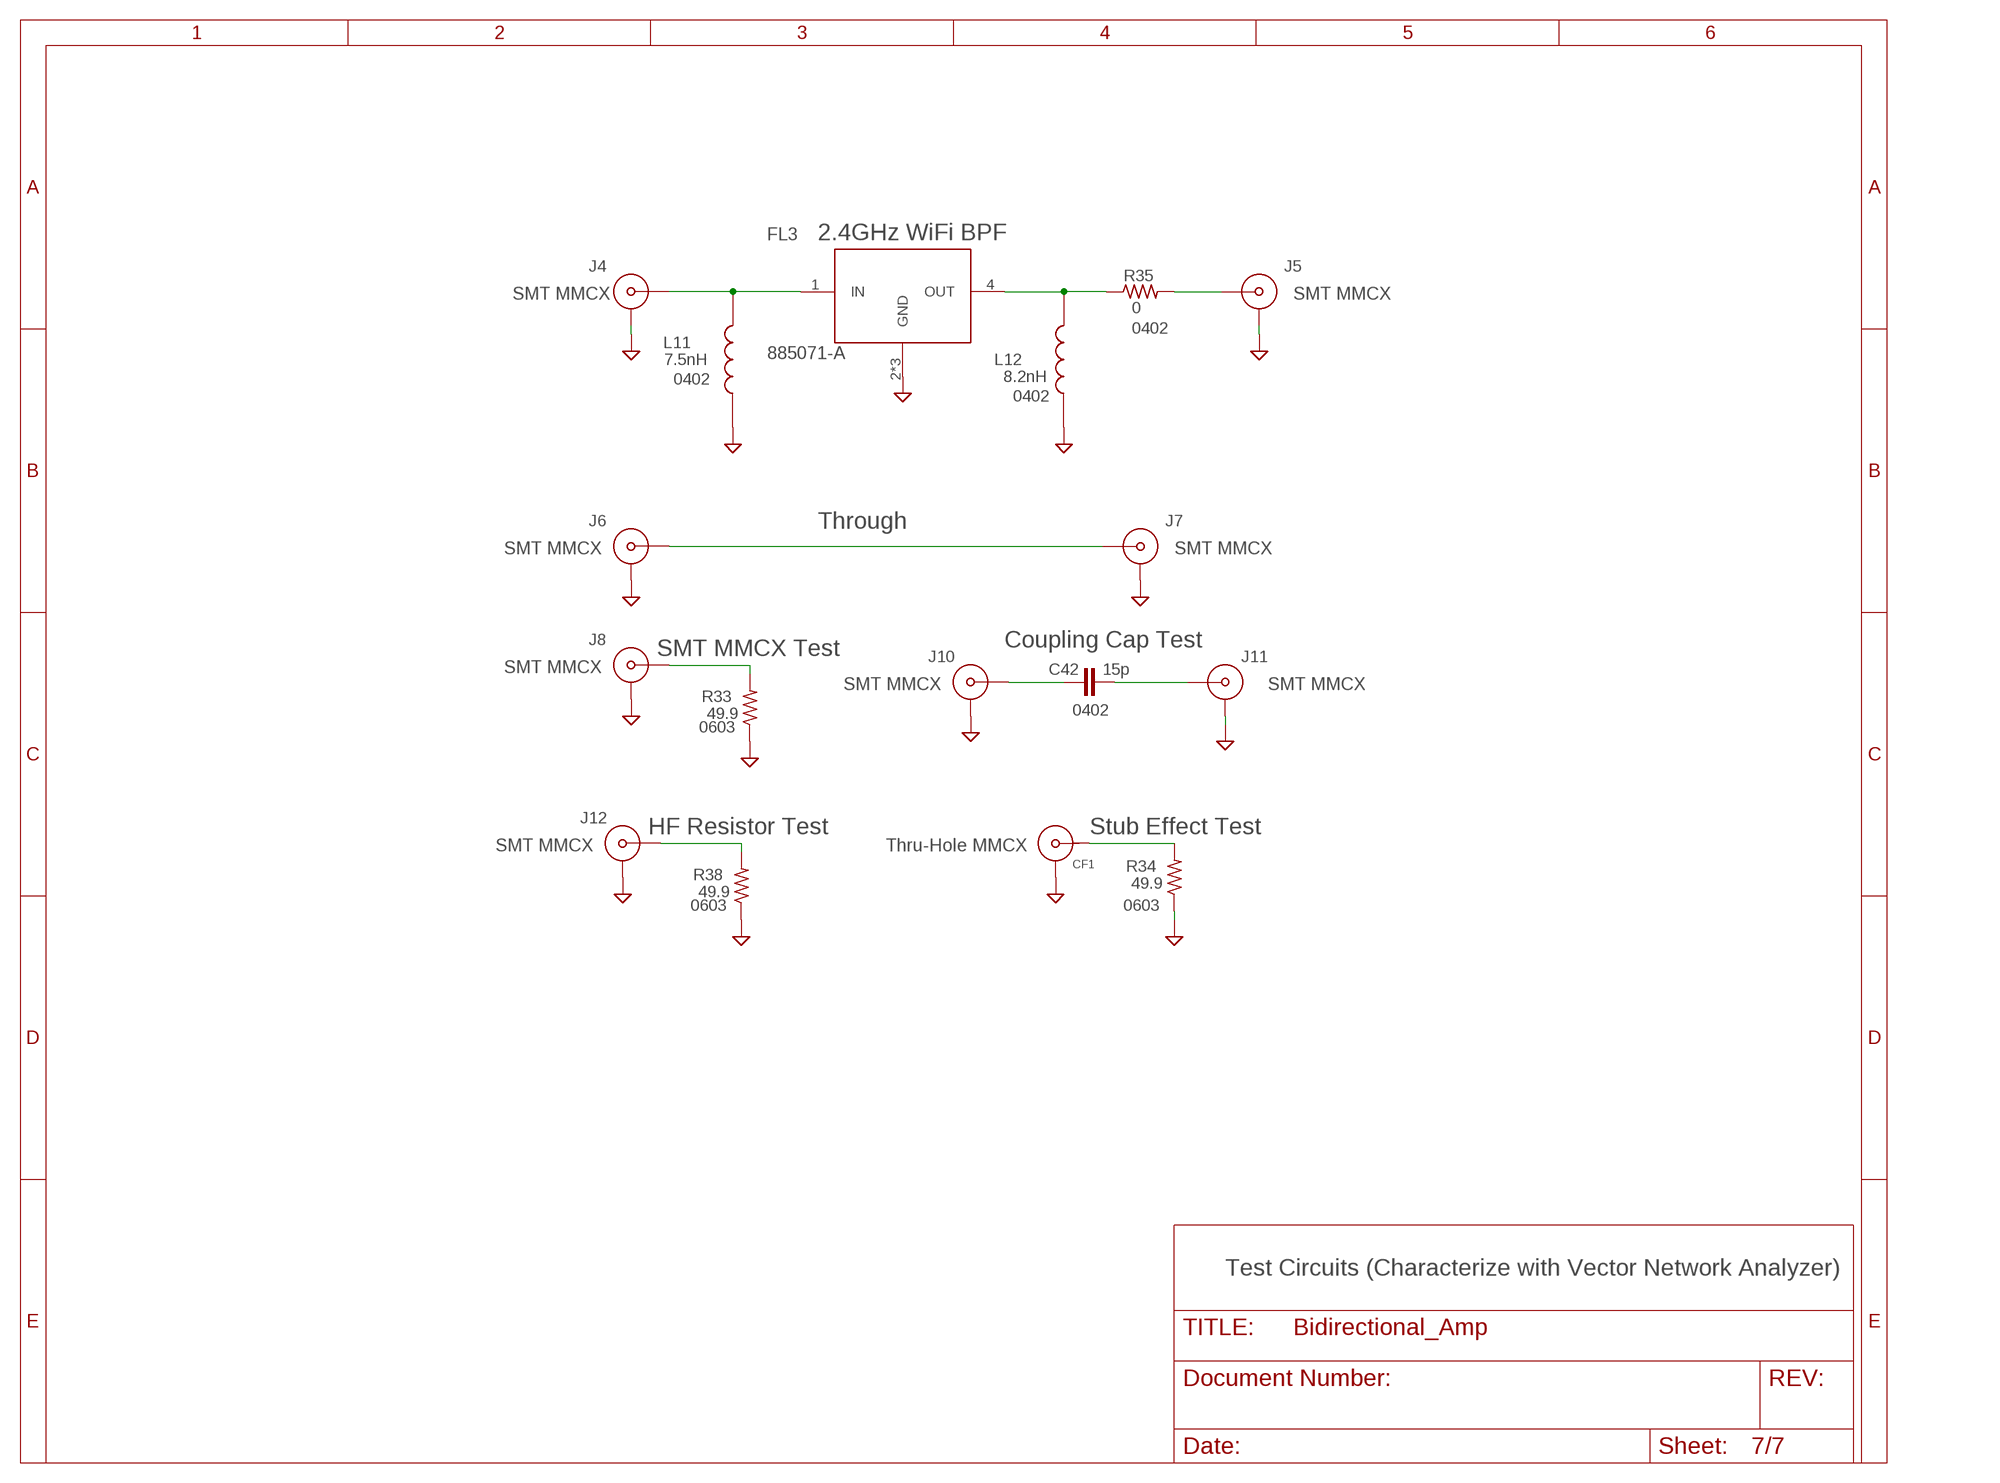
[diagram p6: schematic, sheet 7]

### Parts
C42  15p  C-EU0402-B-NOSILK  [.0402-B-NOSILK]
CF1  CON-MMCX-F-MOLEX-0734151001  [CON-MMCX-F-MOLEX-0734151001]
FL3  885071-A  [FIL_B39162B9417K610]
J4  73415-2061  [73415-2063]
J5  73415-2061  [73415-2063]
J6  73415-2061  [73415-2063]
J7  73415-2061  [73415-2063]
J8  73415-2061  [73415-2063]
J10  73415-2061  [73415-2063]
J11  73415-2061  [73415-2063]
J12  73415-2061  [73415-2063]
L11  7.5nH  0402CS-1N2XJLW  [0402CS1N2XJLW]
L12  8.2nH  0402CS-1N2XJLW  [0402CS1N2XJLW]
R33  49.9  R-US_R0603  [R0603]
R34  49.9  R-US_R0603  [R0603]
R35  0  R-US_0402-B-NOSILK  [.0402-B-NOSILK]
R38  49.9  R-US_R0603  [R0603]

### Nets
GND: CF1.G1(SHIELD) CF1.G2(SHIELD) CF1.G3(SHIELD) CF1.G4(SHIELD) FL3.2(GND) FL3.3(GND) FL3.5(GND) J4.2(GND) J4.3(GND) J4.4(GND) J4.5(GND) J5.2(GND) J5.3(GND) J5.4(GND) J5.5(GND) J6.2(GND) J6.3(GND) J6.4(GND) J6.5(GND) J7.2(GND) J7.3(GND) J7.4(GND) J7.5(GND) J8.2(GND) J8.3(GND) J8.4(GND) J8.5(GND) J10.2(GND) J10.3(GND) J10.4(GND) J10.5(GND) J11.2(GND) J11.3(GND) J11.4(GND) J11.5(GND) J12.2(GND) J12.3(GND) J12.4(GND) J12.5(GND) L11.1 L12.1 R33.1 R34.1 R38.1 ; also sheet 1,2,3,4,5,6
N$41 [RF]: FL3.4(OUT) L12.2 R35.1
N$46 [RF]: FL3.1(IN) J4.1(CTR) L11.2
N$47 [RF]: J6.1(CTR) J7.1(CTR)
N$48 [RF]: J8.1(CTR) R33.2
N$49 [RF]: CF1.CENTER R34.2
N$50 [RF]: J5.1(CTR) R35.2
N$53 [RF]: C42.1 J10.1(CTR)
N$54 [RF]: C42.2 J11.1(CTR)
N$55 [RF]: J12.1(CTR) R38.2

### Notes on the sheet
- 2.4GHz WiFi BPF
- SMT MMCX | SMT MMCX
- 0402
- 0402
- 0402
- Through
- SMT MMCX | SMT MMCX
- Coupling Cap Test
- SMT MMCX Test
- SMT MMCX
- SMT MMCX | SMT MMCX
- 0402
- 0603
- HF Resistor Test | Stub Effect Test
- SMT MMCX | Thru-Hole MMCX
- 0603 | 0603
- Test Circuits (Characterize with Vector Network Analyzer)

## Library data of the parts
C1 C27 C42 = oresat-rcl:C-EU: CAPACITOR, European symbol; MPN: GJM1555C1H150JB01D
C2 = oresat-rcl:C-EU: CAPACITOR, European symbol; MPN: C1005X7R1C224K050BE
C3 C5 C7 C9 C11-C13 C30 C32 C33 C36 C40 = oresat-rcl:C-EU: CAPACITOR, European symbol; MPN: GCM1555C1H101JA16D
C4 C6 C8 C10 C14 C31 C39 C41 = oresat-rcl:C-EU: CAPACITOR, European symbol; MPN: CGA2B1X7R1C104K050BC
C15-C17 = rcl:C-EU: CAPACITOR, European symbol; MPN: C0603C104K5RACAUTO; SPICEPREFIX: C
C18 C20 = rcl:C-EU: CAPACITOR, European symbol; MPN: GCM1885C1H101JA16D; SPICEPREFIX: C
C19 C37 = rcl:C-EU: CAPACITOR, European symbol; MPN: CGA3E2C0G1H102J080AA; SPICEPREFIX: C
C21 = rcl:C-EU: CAPACITOR, European symbol; MPN: UVK105CG030JW-F; SPICEPREFIX: C
C22 = rcl:C-EU: CAPACITOR, European symbol; MPN: UVK105CG2R2JW-F; SPICEPREFIX: C
C23 = rcl:C-EU: CAPACITOR, European symbol; MPN: GJM1555C1H1R6BB01D; SPICEPREFIX: C
C24 = rcl:C-EU: CAPACITOR, European symbol; MPN: 06032U4R7BAT2A; SPICEPREFIX: C
C25 C35 = rcl:C-EU: CAPACITOR, European symbol; MPN: GCJ32ER71C226KE01L; SPICEPREFIX: C
C26 C28 = rcl:C-EU: CAPACITOR, European symbol; MPN: GJM1555C1H150JB01D; SPICEPREFIX: C
C29 = rcl:C-EU: CAPACITOR, European symbol; MPN: C0603X105M4RACAUTO; SPICEPREFIX: C
C34 = rcl:C-EU: CAPACITOR, European symbol; MPN: GCJ31CR71C475KA01L; SIZE: 1206; SPICEPREFIX: C; TEMP: X7R; VOLTAGE: 16V
C38 = oresat-rcl:C-EU: CAPACITOR, European symbol; MPN: GCM1555C1H220JA16J
CF1 = oresat-connectors:CON-MMCX-F-MOLEX-0734151001: MMCX, Female, Through Hole, Right angle. Modeled after Molex 0734151001.; MPN: 0734151001
D1 D2 = SparkFun-DiscreteSemi:DIODE-SCHOTTKY: Schottky diode A Schottky diode is a semiconductor diode which has a low forward voltage drop and a very fast switching action.; MPN: PMEG1020EJ,115; PROD_ID: DIO-10955
FL1-FL3 = U-Qorvo-885071_A-2.4GHz-BPF:885071-A: 2.4GHz BPF; MFR: Qorvo; MPN: 885071-A
H1-H4 = SparkFun-Hardware:STAND-OFF: Stand Off Drill holes for mechanically mounting via screws, standoffs, etc. Note: Use the keepout ring to avoid running the screw head into surrounding components. Variant Overviews STAND-OFF - Mechanical footprint for a #4 phillips button head screw. STAND-OFF-TIGHT - Mechanical footprint for a #4 phillips button head screw, Example SparkFun Products Screw - Phillips Head (1/4", 4-40, 10 pack) <https://www.sparkfun.com/products/10453> (PRT-10453) Screw - Phillips Head (1/2", 4-40, 10 pack) <https://www.sparkfun.com/products/10452> (PRT-10452) Screw - Phillips Head (3/4", 4-40, 10 pack) <https://www.sparkfun.com/products/10451> (PRT-10451) Screw - Phillips Head (1", 4-40, 10 pack) <https://www.sparkfun.com/products/10450> (PRT-10450)
J1 J2 J4-J8 J10-J12 = SamacSys_Parts:73415-2061: MMCX 50 Ohm SMT PCB mount vertical jack Molex 50 Straight PCB Mount MMCX Connector, jack, Solder Termination, DC to 6GHz, RG178 Source: Datasheet <https://componentsearchengine.com/Datasheets/2/73415-2061.pdf>; DESCRIPTION: MMCX 50 Ohm SMT PCB mount vertical jack Molex 50 Straight PCB Mount MMCX Connector, jack, Solder Termination, DC to 6GHz, RG178; MFR: Molex; MPN: 0734152061
J3 = SparkFun-Connectors:CONN_08: Multi connection point. Often used as Generic Header-pin footprint for 0.1 inch spaced/style header connections On any of the 0.1 inch spaced packages, you can populate with these: Break Away Headers - Straight <https://www.sparkfun.com/products/116> (PRT-00116) Break Away Male Headers - Right Angle <https://www.sparkfun.com/products/553> (PRT-00553) Female Headers <https://www.sparkfun.com/products/115> (PRT-00115) Break Away Headers - Machine Pin <https://www.sparkfun.com/products/117> (PRT-00117) Break Away Female Headers - Swiss Machine Pin <https://www.sparkfun.com/products/743> (PRT-00743) Arduino Stackable Header - 8 Pin <https://www.sparkfun.com/products/9279> (PRT-09279) For SCREWTERMINALS and SPRING TERMINALS visit here: Screw Terimnals on SparkFun.com <https://www.sparkfun.com/search/results?term=Screw+Terminals> (5mm/3.5mm/2.54mm spacing) This device is also useful as a general connection point to wire up your design to another part of your project. Our various solder wires solder well into these plated through hole pads. Hook-Up Wire - Assortment (Stranded, 22 AWG) <https://www.sparkfun.com/products/11375> (PRT-11375) Hook-Up Wire - Assortment (Solid Core, 22 AWG) <https://www.sparkfun.com/products/11367> (PRT-11367) View the entire wire category on our website here <https://www.sparkfun.com/categories/141> Special notes: Molex polarized connector foot print use with SKU : PRT-08231 with associated crimp pins and housings. 1MM SMD Version SKU: PRT-10208 NOTES ON THE VARIANTS LOCK and LOCK_LONGPADS... This footprint was designed to help hold the alignment of a through-hole component (i.e. 6-pin header) while soldering it into place. You may notice that each hole has been shifted either up or down by 0.005 of an inch from it's more standard position (which is a perfectly straight line). This slight alteration caused the pins (the squares in the middle) to touch the edges of the holes. Because they are alternating, it causes a "brace" to hold the component in place. 0.005 has proven to be the perfect amount of "off-center" position when using our standard breakaway headers. Although looks a little odd when you look at the bare footprint, once you have a header in there, the alteration is very hard to notice. Also,if you push a header all the way into place, it is covered up entirely on the bottom side.
J9 = SparkFun-Connectors:CONN_03: Multi connection point. Often used as Generic Header-pin footprint for 0.1 inch spaced/style header connections On any of the 0.1 inch spaced packages, you can populate with these: Break Away Headers - Straight <https://www.sparkfun.com/products/116> (PRT-00116) Break Away Male Headers - Right Angle <https://www.sparkfun.com/products/553> (PRT-00553) Female Headers <https://www.sparkfun.com/products/115> (PRT-00115) Break Away Headers - Machine Pin <https://www.sparkfun.com/products/117> (PRT-00117) Break Away Female Headers - Swiss Machine Pin <https://www.sparkfun.com/products/743> (PRT-00743) Stackable Header - 3 Pin (Female, 0.1") <https://www.sparkfun.com/products/13875> (PRT-13875) For SCREWTERMINALS and SPRING TERMINALS visit here: Screw Terimnals on SparkFun.com <https://www.sparkfun.com/search/results?term=Screw+Terminals> (5mm/3.5mm/2.54mm spacing) This device is also useful as a general connection point to wire up your design to another part of your project. Our various solder wires solder well into these plated through hole pads. Hook-Up Wire - Assortment (Stranded, 22 AWG) <https://www.sparkfun.com/products/11375> (PRT-11375) Hook-Up Wire - Assortment (Solid Core, 22 AWG) <https://www.sparkfun.com/products/11367> (PRT-11367) View the entire wire category on our website here <https://www.sparkfun.com/categories/141> Special notes: Molex polarized connector foot print use with SKU : PRT-08232 with associated crimp pins and housings.
L1 = SamacSys_Parts:1008HQ-10NXJLB: Fixed Inductors 1008HQ 10 nH 5 % 1.6 A; DESCRIPTION: Fixed Inductors 1008CS AEC-Q200 150 nH 5 % 0.58 A; MFR: COILCRAFT; MPN: 1008HQ-10NXJLB
L2 = SamacSys_Parts:0805CS-060XJLC: Fixed Inductors 0805CS Ceramic Chip 6.8 nH 5 % 0.6 A; DESCRIPTION: Fixed Inductors 0805CS Ceramic Chip 6.8 nH 5 % 0.6 A; HEIGHT: mm; MFR: COILCRAFT; MPN: 0805CS-060XJLC
L3 = SamacSys_Parts:0402CS-1N2XJLW: RF inductor, ceramic core, 5% tol, SMT, RoHS, halogen-free Source: Datasheet <https://www.coilcraft.com/misc/0402csd.html>; DESCRIPTION: RF inductor, ceramic core, 5% tol, SMT, RoHS, halogen-free; HEIGHT: 0mm; MFR: COILCRAFT; MPN: 0402CS-1N2XJLW
L4 = SamacSys_Parts:0603CS-68NXJLW: Fixed Inductors 0603CS High Q, 68nH 0.6A Source: Datasheet <https://www.coilcraft.com/pdfs/0603cs.pdf>; HEIGHT: 1mm; MFR: COILCRAFT; MPN: 0603CS-68NXJLW
L5 L7 L11 = SamacSys_Parts:0402CS-1N2XJLW: RF inductor, ceramic core, 5% tol, SMT, RoHS, halogen-free Source: Datasheet <https://www.coilcraft.com/misc/0402csd.html>; DESCRIPTION: RF inductor, ceramic core, 5% tol, SMT, RoHS, halogen-free; HEIGHT: 0mm; MFR: COILCRAFT; MPN: 0402CS-7N5XGLU; VALUE: 1.2nH
L6 L8 L12 = SamacSys_Parts:0402CS-1N2XJLW: RF inductor, ceramic core, 5% tol, SMT, RoHS, halogen-free Source: Datasheet <https://www.coilcraft.com/misc/0402csd.html>; DESCRIPTION: RF inductor, ceramic core, 5% tol, SMT, RoHS, halogen-free; HEIGHT: 0mm; MFR: COILCRAFT; MPN: 0402CS-8N2XGLU; VALUE: 1.2nH
L9 L10 = SamacSys_Parts:XFL4020-222MEB: Fixed Inductors 2.2uH 20% 8A 23.5mOhms AEC-Q200 Source: Datasheet <https://www.coilcraft.com/pdfs/xfl4020.pdf>; DESCRIPTION: Fixed Inductors 2.2uH 20% 8A 23.5mOhms AEC-Q200; MFR: COILCRAFT; MPN: XFL4020-222MEB
LED1 = SamacSys_Parts:LTST-C193KRKT-5A: LED,SMD,0603,Red, Lite-On LTST-C193KRKT-5A Red LED, 631 nm, 1608 (0603), Rectangle Lens SMD Package Source: Datasheet <http://docs-europe.electrocomponents.com/webdocs/0dc0/0900766b80dc02a7.pdf>; DESCRIPTION: LED,SMD,0603,Red,Lite-On 1608 (0603), Rectangle Lens SMD Package; MFR: Lite-On; MPN: LTST-C193KRKT-5A
LED2 = SamacSys_Parts:LTST-C193KGKT-5A: LED,SMD,0603,Green, Lite-On LTST-C193KGKT-5A 1608 (0603), Rectangle Lens SMD Package Source: Datasheet <http://docs-europe.electrocomponents.com/webdocs/0dc0/0900766b80dc02a7.pdf>; DESCRIPTION: LED,SMD,0603,Green,Lite-On 1608 (0603), Rectangle Lens SMD Package; MFR: Lite-On; MPN: LTST-C193KGKT-5A
PD1 = SamacSys_Parts:PD2328J5050S2HF: Ultra Low Profile 0805 Power Divider Source: Datasheet <https://www.anaren.com/sites/default/files/PD2328J5050S2HF_DataSheet_RevA.pdf>; DESCRIPTION: Ultra Low Profile 0805 Power Divider; HEIGHT: mm; MFR: ANAREN; MPN: PD2328J5050S2HF
R1 R2 = rcl:R-US_: RESISTOR, American symbol; MPN: ERJ-3EKF1470V; SPICEPREFIX: R
R3 = rcl:R-US_: RESISTOR, American symbol; MPN: ERJ-3EKF17R8V; SPICEPREFIX: R
R4 = rcl:R-US_: RESISTOR, American symbol; MPN: ERJ-3EKF2940V; SPICEPREFIX: R
R5 R6 R8 = rcl:R-US_: RESISTOR, American symbol; SPICEPREFIX: R
R7 R23 = rcl:R-US_: RESISTOR, American symbol; MPN: ERJ-3GEY0R00V; SPICEPREFIX: R
R9 R13 R15 R21 R24 R26 R30 = oresat-rcl:R-US_: RESISTOR, American symbol; MPN: ERJ-2RKF1002X
R10 = oresat-rcl:R-US_: RESISTOR, American symbol; MPN: ERJ-2RKF1911X
R11 R12 = oresat-rcl:R-US_: RESISTOR, American symbol; MPN: ERJ-2RKF4993X
R14 R16 R25 R27 = oresat-rcl:R-US_: RESISTOR, American symbol; MPN: ERJ-2RKF5621X
R17 = rcl:R-US_: RESISTOR, American symbol; MPN: ERJ-6GEY0R00V; SPICEPREFIX: R
R18 = rcl:R-US_: RESISTOR, American symbol; MPN: ERJ-2GEJ1R2X; SPICEPREFIX: R
R19 = rcl:R-US_: RESISTOR, American symbol; MPN: ERJ-3EKF1100V; SPICEPREFIX: R
R20 = rcl:R-US_: RESISTOR, American symbol; MPN: ERJ-3EKF2200V; SPICEPREFIX: R
R22 = oresat-rcl:R-US_: RESISTOR, American symbol; MPN: ERJ-2GEJ333X
R28 = oresat-rcl:R-US_: RESISTOR, American symbol; MPN: ERJ-2RKF3833X
R29 = oresat-rcl:R-US_: RESISTOR, American symbol; MPN: ERJ-2RKF1213X
R31 R37 = oresat-rcl:R-US_: RESISTOR, American symbol; MPN: ERJ-2GEJ103X
R32 R36 = oresat-rcl:R-US_: RESISTOR, American symbol; MPN: ERJ-2GEJ621X
R33 R34 = rcl:R-US_: RESISTOR, American symbol; MPN: ERJ-3EKF49R9V; SPICEPREFIX: R
R35 = oresat-rcl:R-US_: RESISTOR, American symbol; MPN: ERJ-2GE0R00X
R38 = rcl:R-US_: RESISTOR, American symbol; MPN: MCT06030C4999FP500; SPICEPREFIX: R
R39 = oresat-rcl:R-US_: RESISTOR, American symbol; MPN: ERJ-3EKF1000V; PARTNUM: ERJ-3EKF1000V
S1 = T211SY9CKE:T201MH9V3BE: Toggle Switches ON ON ON SPDT Source: Datasheet <https://www.ckswitches.com/media/1391/ttoggle.pdf>; DESCRIPTION: Toggle Switches ON None ON DPDT 20VAC 20VDC 0.4W; HEIGHT: 20mm; MFR: C & K COMPONENTS; MPN: T211SY9CQE
U1 = LTC5536ES6:LTC5536ES6TRMPBF; MFR: Linear Technology; MPN: LTC5536
U2 U3 = LTC6994CS6-1_UL:LTC6994CS6-1PBF; MFR: Linear Technology; MPN: LTC6994-1
U4 = U-Qorvo-QPC1022-RF-SPDT-switch:QPC1022; MFR: Qorvo; MPN: QPC1022SR
U5 = SamacSys_Parts:NC7S04M5XX: Inverter 1-Element CMOS 5-Pin SOT-23 Fairchild Semiconductor NC7S04M5X CMOS Inverter, 2 6 V, 5-Pin SOT-23 Source: Datasheet <https://docs-emea.rs-online.com/webdocs/0d1d/0900766b80d1df2f.pdf>; DESCRIPTION: Inverter 1-Element CMOS 5-Pin SOT-23 Fairchild Semiconductor NC7S04M5X CMOS Inverter, 2 6 V, 5-Pin SOT-23; HEIGHT: 1.4mm; MFR: ON Semiconductor; MPN: NC7S04M5XX
U6 = tqp9111:TQP9111
U7 = TQP3M9035:TQP3M9035; MFR: Qorvo; MPN: TQP3M9035
U8 = U-Qorvo-QPC1022-RF-SPDT-switch:QPC1022; MFR: Qorvo; MPN: QPC1022
U9 = LTC3428:LTC3428EDDPBF; MFR: Linear Technology; MPN: LTC3428EDD#PBF
U10 = SamacSys_Parts:NC7S32M5X: TinyLogic HS 2-Input OR Gate Source: Datasheet; DESCRIPTION: TinyLogic HS 2-Input OR Gate; MFR: ON Semiconductor; MPN: NC7S32M5X
U11 = SamacSys_Parts:SN74LV1T34DBVR: Single Power Supply BUFFER Logic Level Shifter (no enable) Source: Datasheet <http://www.ti.com/lit/gpn/sn74lv1t34>; DESCRIPTION: Single Power Supply BUFFER Logic Level Shifter (no enable); MFR: Texas Instruments; MPN: SN74LV1T34DBVR

## Net classes
1 RF: clearance 0.75 mm

## Board
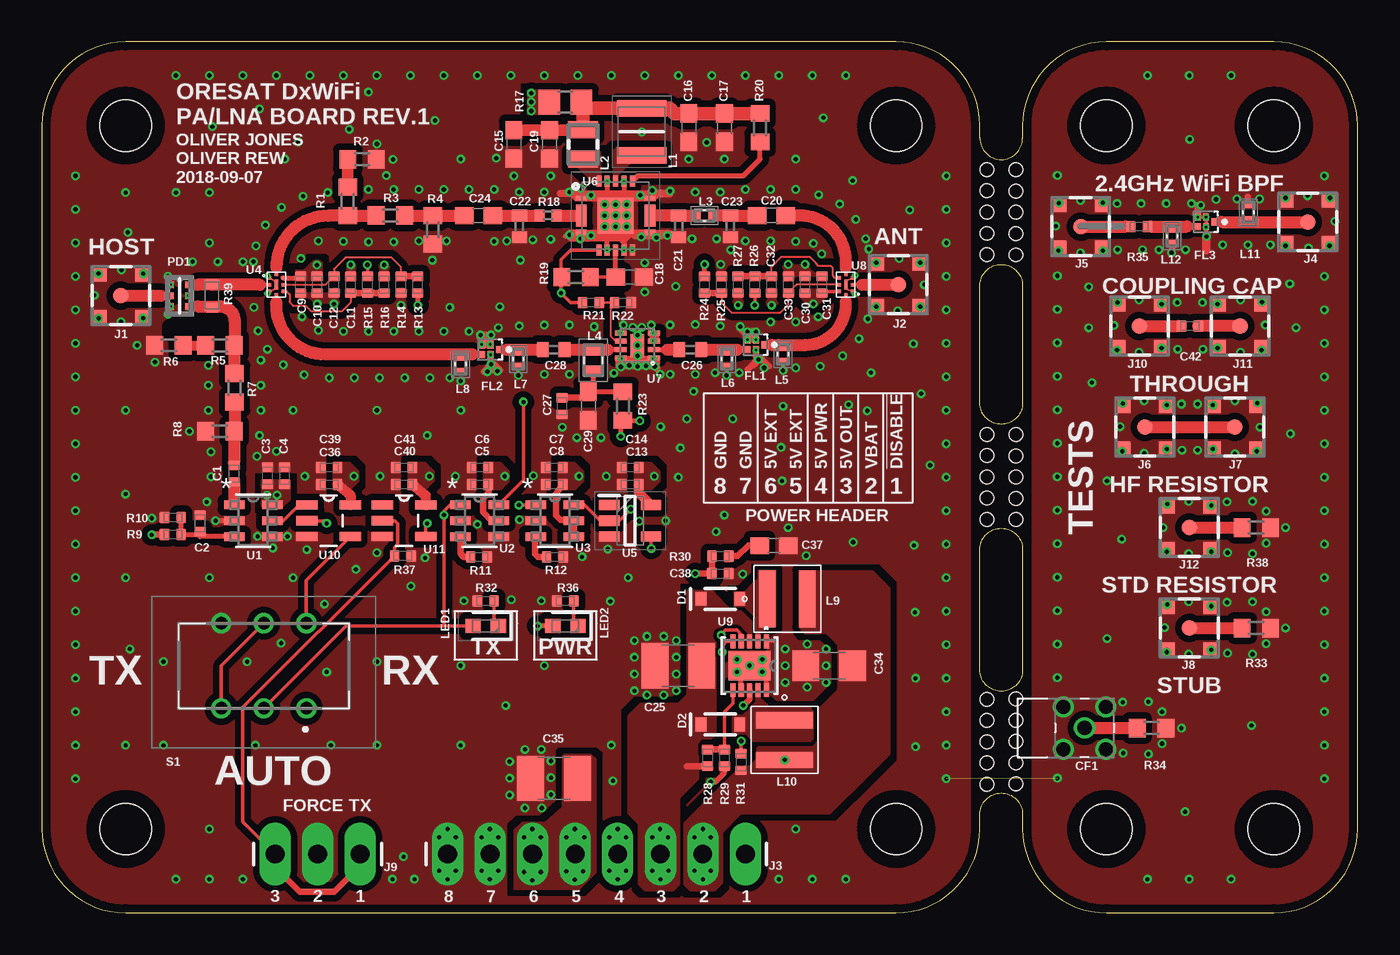
[diagram p7: board, top side]
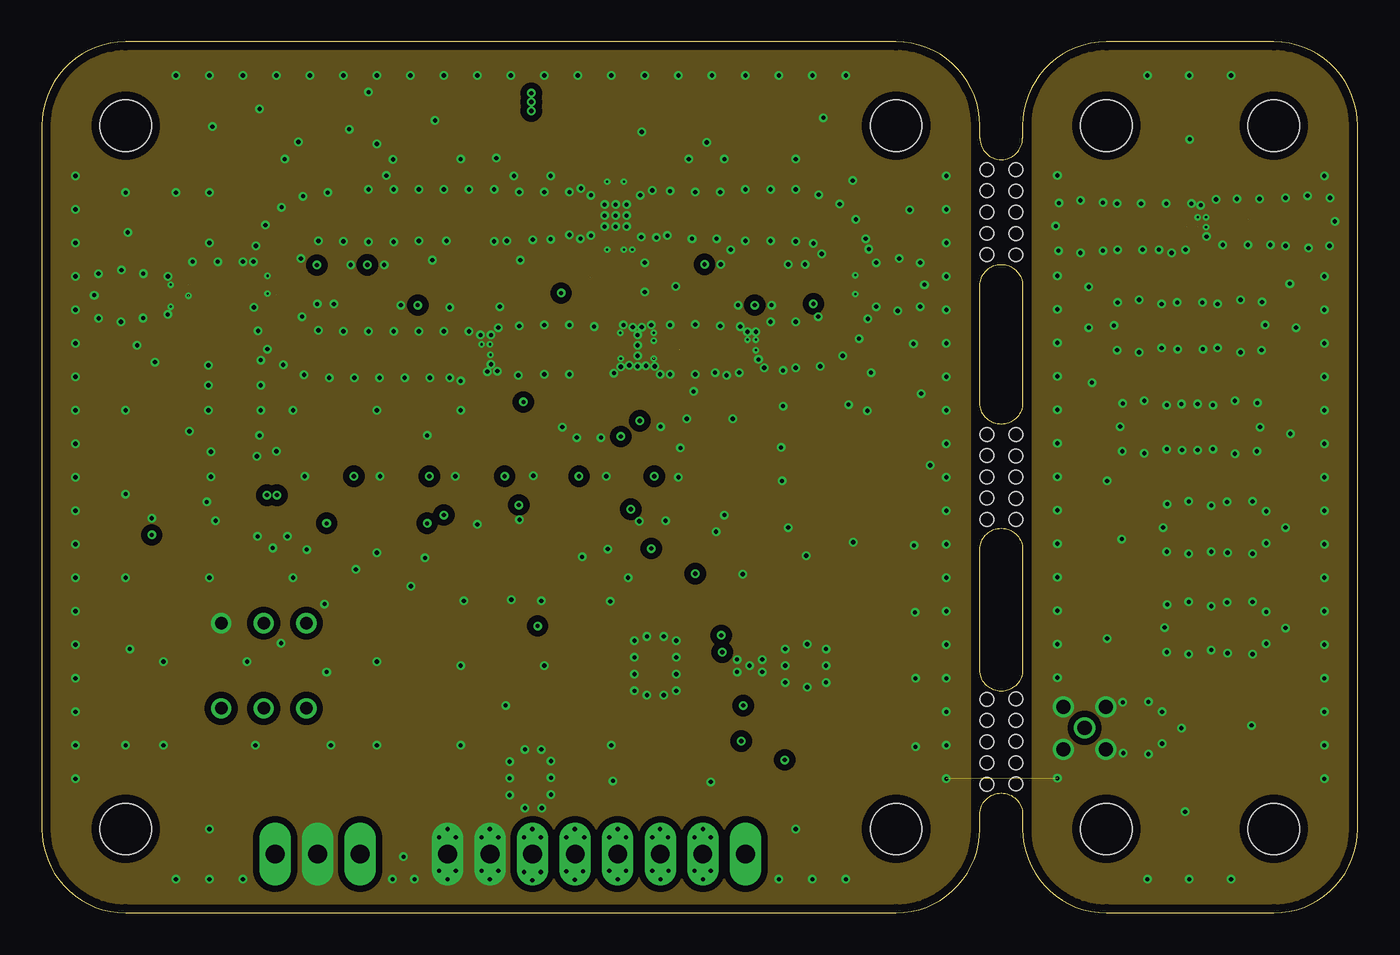
[diagram p8: board, inner layer Route2]
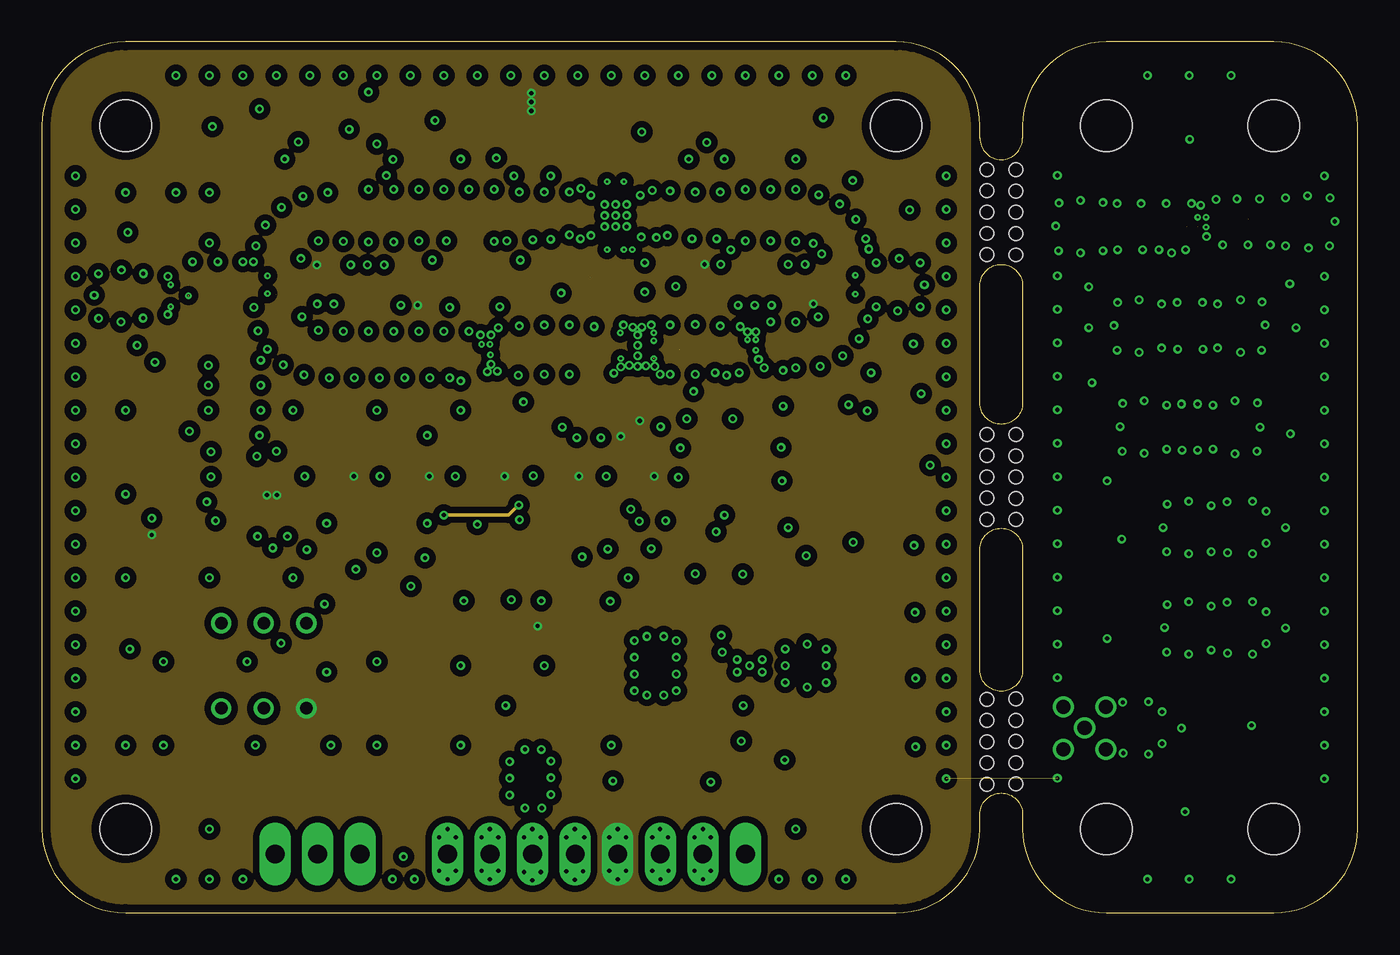
[diagram p9: board, inner layer Route15]
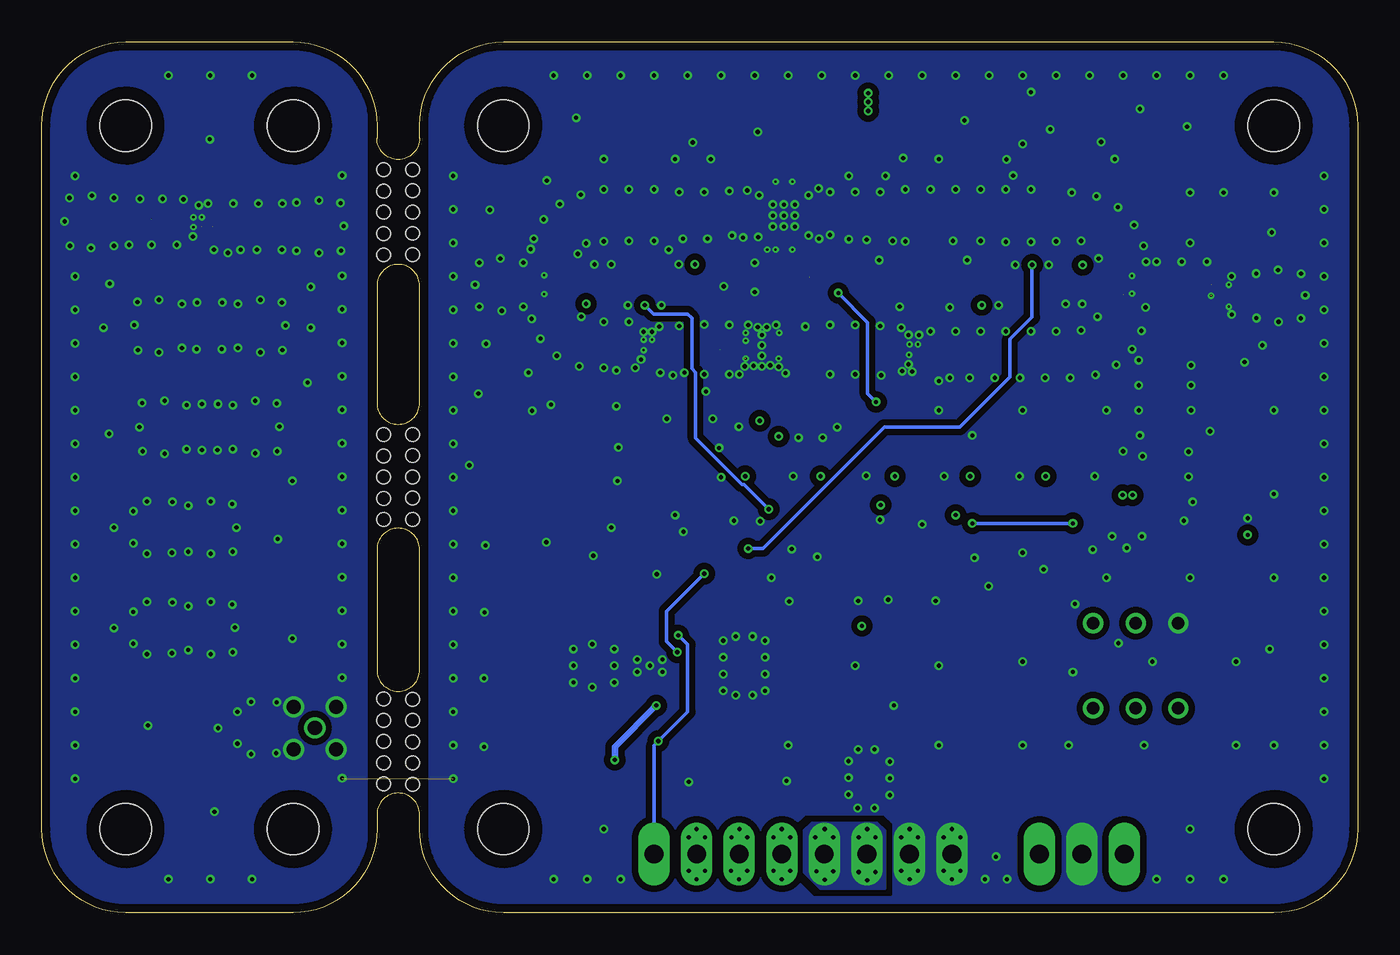
[diagram p10: board, bottom side, seen from below]

Size 78.55 x 52 mm. Coordinates in mm from the lower left corner, seen from the top.
Outline: 0,47 0,5 arc90 5,0 51,0 arc90 56,5 56,5.88 arc-180 58.55,5.88 58.55,5 arc90 63.55,0 73.55,0 arc90 78.55,5 78.55,47 arc90 73.55,52 63.55,52 arc90 58.55,47 58.55,46.25 arc-180 56,46.25 56,47 arc90 51,52 5,52 arc90 0,47
Outline: 56,19.5 56,21.69 arc-90 57.27,22.96 arc-90 58.55,21.69 58.55,14.5 arc-90 57.27,13.22 arc-90 56,14.5 56,19.5
Outline: 56,35.44 56,37.44 arc-90 57.27,38.71 arc-90 58.55,37.44 58.55,30.44 arc-90 57.27,29.16 arc-90 56,30.44 56,35.44
Copper layers (1+2*15+16): Top 0.0178mm / dielectric 0.33781875mm / Route2 0.0356mm / dielectric 0.81mm / Route15 0.0356mm / dielectric 0.33781875mm / Bottom 0.0178mm
Design rules "SSC-EAGLE-4Lyr_v1.0.0.3 *": minimum track width 5mil, minimum drill 5mil, track to track 5mil, track to pad 5mil, pad to pad 5mil, via to via 5mil, smd to smd 5mil, copper to edge 20mil, drill to drill 0.3mm, minimum pad ring 5mil, minimum via ring 5mil, stop-mask expansion 3mil, vias tented up to drill 2mm, thermal gap 10mil
Holes 0.79 mm at 56.41,44.38 56.41,43.1 56.41,41.84 56.41,40.56 56.41,39.3 58.15,44.36 58.15,43.09 58.15,41.82 58.15,40.55 58.15,39.28 56.41,28.56 56.41,27.29 56.41,26.02 56.41,24.75 56.41,23.48 58.15,28.55 58.15,27.28 58.15,26.01 58.15,24.74 58.15,23.47 56.41,12.75 56.41,11.48 56.41,10.21 56.41,8.94 56.41,7.67 58.15,12.77 58.15,11.5 58.15,10.23 58.15,8.96 58.15,7.69
tRestrict: area 55.9,-0.4 to 58.7,51.9; area 7.6,34.5 to 10.5,35.5
bRestrict: area 55.9,-0.4 to 58.7,51.9

### Footprints (pad centres in the part's own frame; a part is rotated, then mirrored left to right if it is on the bottom)
.0402-B-NOSILK = smd 0.6 x 0.7: 1 -0.5,0; 2 0.5,0
C0603 = smd 1.1 x 1: 1 -0.85,0; 2 0.85,0
C0402 = smd 0.7 x 0.9: 1 -0.65,0; 2 0.65,0
C1210 = smd 1.6 x 2.7: 1 -1.4,0; 2 1.4,0
C1206 = smd 1.6 x 1.8: 1 -1.4,0; 2 1.4,0
CON-MMCX-F-MOLEX-0734151001 = drill 0.84: CENTER 0,0; G1 -1.27,1.27; G2 -1.27,-1.27; G3 1.27,-1.27; G4 1.27,1.27
SOD-323 = smd 0.63 x 0.83: A 1.15,0; C -1.15,0
FIL_B39162B9417K610 = smd 0.35 x 0.425: 1 -0.5,0; 2 0,-0.287; 3 0.5,-0.287; 4 0.5,0.287; 5 0,0.287
STAND-OFF-TIGHT = hole 3.048: 0,0
STAND-OFF-TIGHT@1 = hole 3.048: 0,0
73415-2063 = smd 0.94 x 0.94: 1 0,0; 2 -1.32,-1.32; 3 1.32,-1.32; 4 1.32,1.32; 5 -1.32,1.32
1X08_LONGPADS = drill 1.118 pad 1.88 long: 1 0,0; 2 2.54,0; 3 5.08,0; 4 7.62,0; 5 10.16,0; 6 12.7,0; 7 15.24,0; 8 17.78,0
1X03_LONGPADS = drill 1.118 pad 1.88 long: 1 0,0; 2 2.54,0; 3 5.08,0
INDC2928X203N = smd 1 x 2.95: 1 -1.4,0; 2 1.4,0
0805CS = smd 1.78 x 1.02: 1 0,-0.89; 2 0,0.89
0402CS1N2XJLW = smd 0.66 x 0.36: 1 0,0.41; 2 0,-0.41
0603CS-68NXJLW = smd 1.02 x 0.64: 1 0,0.64; 2 0,-0.64
XFL4020-222ME = smd 0.98 x 3.4: 1 -1.185,0; 2 1.185,0
LEDC1607X80N = smd 0.9 x 0.85: 1 -0.75,0; 2 0.75,0
PSON65P204X129X58-6N = smd 0.35 x 0.4: 1 -0.525,0.65; 2 -0.525,0; 3 -0.525,-0.65; 4 0.525,-0.65; 5 0.525,0; 6 0.525,0.65
R0603 = smd 1 x 1.1: 1 -0.85,0; 2 0.85,0
R0805 = smd 1.3 x 1.5: 1 -0.95,0; 2 0.95,0
R0402 = smd 0.6 x 0.7: 1 -0.5,0; 2 0.5,0
.0603-C-NOSILK = smd 0.6 x 0.9: 1 -0.7,0; 2 0.7,0
T201MH9V3BE = drill 0.75 pad 1.2: 1 -2.54,-2.54; 2 -2.54,0; 3 -2.54,2.54; 4 2.54,-2.54; 5 2.54,0; 6 2.54,2.54
TSOT-23_S6 = smd 1.219 x 0.508: 1 -1.143,0.95; 2 -1.143,0; 3 -1.143,-0.95; 4 1.143,-0.95; 5 1.143,0; 6 1.143,0.95
QPC1022 = smd 0.2 x 0.2: 1 -0.4,0.4; 2 -0.4,0; 3 -0.4,-0.4; 4 0,-0.6; 5 0.4,-0.4; 6 0.4,0; 7 0.4,0.4; 8 0,0.6 | smd 0.2 x 0.6: 9 0,0
SOT95P280X140-5N = smd 1.2 x 0.6: 1 -1.25,0.95; 2 -1.25,0; 3 -1.25,-0.95; 4 1.25,-0.95; 5 1.25,0.95
SAMACSYS_PARTS_QFN50P400X400X102-21N = smd 0.65 x 0.3: 1 -2.05,1; 5 -2.05,-1; 11 2.05,-1; 15 2.05,1 | smd 0.65 x 1.3: 1_2_3 -2.05,0; 13_14_15 2.05,0 | smd 0.3 x 0.65: 6 -1,-2.05; 7 -0.5,-2.05; 8 0,-2.05; 9 0.5,-2.05; 10 1,-2.05; 16 1,2.05; 17 0.5,2.05; 18 0,2.05; 19 -0.5,2.05; 20 -1,2.05 | smd 2.15 x 2.15: 21 0,0
DFN-8 = smd 0.3 x 0.7: 1 -0.75,-0.99; 2 -0.25,-0.99; 3 0.25,-0.99; 4 0.75,-0.99; 5 0.75,0.99; 6 0.25,0.99; 7 -0.25,0.99; 8 -0.75,0.99 | smd 1.38 x 0.8: 9 0,0
DFN-10_DD = smd 0.813 x 0.305: 1 -1.448,1; 2 -1.448,0.5; 3 -1.448,0; 4 -1.448,-0.5; 5 -1.448,-1; 6 1.448,-1; 7 1.448,-0.5; 8 1.448,0; 9 1.448,0.5; 10 1.448,1 | smd 1.753 x 2.489: 11 0,0
SOT95P280X145-5N = smd 1.27 x 0.559: 1 -1.295,0.94; 2 -1.295,0; 3 -1.295,-0.94; 4 1.295,-0.94; 5 1.295,0.94

### Placement (x,y rotation side)
C1  11.47,26.22 270 top
C2  9.44,23.25 90 top
C3  13.47,26.09 90 top
C4  14.5,26.09 90 top
C5  26.16,25.56 180 top
C6  26.16,26.59 180 top
C7  30.59,26.59 180 top
C8  30.59,25.56 180 top
C9  15.44,37.5 270 top
C10  16.44,37.5 270 top
C11  18.44,37.5 90 top
C12  17.44,37.5 270 top
C13  35.12,25.56 180 top
C14  35.12,26.59 180 top
C15  28.18,45.88 270 top
C16  38.62,46.88 270 top
C17  40.75,46.88 270 top
C18  35.1,37.95 0 top
C19  30.3,45.88 270 top
C20  43.55,41.63 0 top
C21  38.01,40.98 270 top
C22  28.51,40.97 270 top
C23  41.1,40.97 270 top
C24  26.06,41.62 0 top
C25  38,14.75 180 top
C26  38.71,33.63 180 top
C27  31.05,30.25 90 top
C28  30.55,33.63 180 top
C29  32.62,30.25 270 top
C30  45.56,37.5 90 top
C31  46.56,37.5 90 top
C32  43.56,37.5 270 top
C33  44.56,37.5 90 top
C34  47,14.75 180 top
C35  30.58,8.03 180 top
C36  17.16,25.56 180 top
C37  43.7,21.92 0 top
C38  40.5,20.25 0 top
C39  17.16,26.59 180 top
C40  21.62,25.56 180 top
C41  21.62,26.59 180 top
C42  68.53,35.03 0 top
CF1  62.25,11.03 90 top
D1  40.5,18.75 0 top
D2  40.5,11.25 0 top
FL1  42.63,33.91 180 top
FL2  26.78,33.62 180 top
FL3  69.5,41.25 180 top
H1  51,5 0 top
H2  5,5 0 top
H3  5,47 0 top
H4  51,47 0 top
H5  STAND-OFFTIGHT  [STAND-OFF-TIGHT@1]  73.55,5 0 top
H6  STAND-OFFTIGHT  [STAND-OFF-TIGHT@1]  63.55,5 0 top
H7  STAND-OFFTIGHT  [STAND-OFF-TIGHT@1]  63.55,47 0 top
H8  STAND-OFFTIGHT  [STAND-OFF-TIGHT@1]  73.55,47 0 top
J1  4.72,36.84 0 top
J2  51.12,37.5 0 top
J3  42,3.5 180 top
J4  75.57,41.25 270 top
J5  62.02,40.97 270 top
J6  65.84,29 270 top
J7  71.22,29 270 top
J8  68.5,17 90 top
J9  19,3.5 180 top
J10  65.53,35.03 270 top
J11  71.53,35.03 270 top
J12  68.5,23 90 top
L1  35.8,46.63 90 top
L2  32.3,45.88 0 top
L3  39.55,41.63 90 top
L4  32.92,32.99 0 top
L5  44.24,33.34 180 top
L6  40.88,33.06 180 top
L7  28.44,33.06 180 top
L8  25,32.75 180 top
L9  44.5,18.75 0 top
L10  44.34,10.31 270 top
L11  72.02,41.83 0 top
L12  67.47,40.4 180 top
LED1  26.5,17.12 180 top
LED2  31.25,17.12 180 top
PD1  8.22,36.84 0 top
R1  18.26,42.47 270 top
R2  19.12,44.99 180 top
R3  20.8,41.63 0 top
R4  23.34,40.78 270 top
R5  10.62,33.88 0 top
R6  7.58,33.88 0 top
R7  11.5,31.34 270 top
R8  10.62,28.75 180 top
R9  7.81,22.59 180 top
R10  7.81,23.59 0 top
R11  26.09,21.25 180 top
R12  30.62,21.25 180 top
R13  22.44,37.5 90 top
R14  21.44,37.5 270 top
R15  19.44,37.5 270 top
R16  20.44,37.5 90 top
R17  31.25,48.4 180 top
R18  30.21,41.63 0 top
R19  31.89,37.95 0 top
R20  42.88,46.88 90 top
R21  32.78,36.44 180 top
R22  34.69,36.44 180 top
R23  34.69,30.25 270 top
R24  39.56,37.5 270 top
R25  40.56,37.5 90 top
R26  42.56,37.5 90 top
R27  41.56,37.5 270 top
R28  39.75,9.25 270 top
R29  40.75,9.25 90 top
R30  40.51,21.29 180 top
R31  41.75,9 270 top
R32  26.5,18.62 0 top
R33  72.5,17 180 top
R34  66.25,11.03 180 top
R35  65.52,40.97 180 top
R36  31.25,18.62 0 top
R37  21.56,21.31 180 top
R38  72.5,23 180 top
R39  10.16,36.84 90 top
S1  13.25,14.75 90 top
U1  12.62,23.41 0 top
U2  26.12,23.41 0 top
U3  30.62,23.41 0 top
U4  14,37.5 0 top
U5  35.12,23.41 0 top
U6  34.25,41.62 0 top
U7  35.55,33.88 90 top
U8  48,37.5 180 top
U9  42.25,14.75 270 top
U10  17.12,23.41 0 top
U11  21.62,23.41 0 top

### Tracks (layer width: path | path; a pad name or v marks a point on that pad's centre or on a via)
+5V  (via drill 0.25, 0.25 pad 0)
  Top 0.203: U8.7 46.81,37.1 C31.1
  Top 0.3: LED2.2 v29.59,17.12 | v34.56,28.44 34.56,29.27 R23.2 34.71,29.38 v35.69,29.38 | R13.1 v22.44,36.28 | R24.1 v39.56,38.72
  Top 0.305: U4.7 15.34,37.9 C9.1
  Top 0.4: C8.1 30.69,25.01 30.69,23.72 30.97,23.44 31.74,23.44 U3.5 U3.4 | R9.2 6.59,22.59 v6.56,22.56 | U2.5 26.84,23.41 26.33,23.92 26.33,24.75 26.66,25.07 C5.1
  Top 0.6: C36.1 18.42,24.95 U10.5 | C40.1 22.92,24.92 U11.5 | C13.1 35.62,25.11 U5.5
  other vias: 33.88,2.5 34.88,2.5 34.38,5 33.88,4.5 34.88,4.5 36.56,26.06 32.06,26.06 27.62,26.06 23.12,26.06 18.62,26.06 46.06,36.36 29.22,48.41 34.38,2 29.22,48.94 29.22,47.88 13.44,24.94 16.42,38.67 14.03,24.94
  pour Route15 (isolate 0.381, rank 2, no thermals): 0,51.95 78.58,51.95 78.58,0 0,0
  pour Top (no thermals): 30.84,48.34 30.84,49.09 29.03,49.09 29.03,47.72 30.75,47.72 30.84,47.72 30.84,48.31
  pour Top (no thermals): 45.41,37.25 46.88,37.25 46.88,37.12 46.88,36.84 46.22,36.19 45.84,36.19 45.56,36.47 45.28,36.75 45.28,37.25
  pour Top (no thermals): 21.94,26.88 22.88,26.88 23.19,26.56 23.38,26.38 23.38,26.06 23.38,25.75 23.25,25.62 22.91,25.28 22,25.28 21.91,25.28 21.91,26.88
  pour Top (no thermals): 26.44,26.88 27.38,26.88 27.69,26.56 27.88,26.38 27.88,26.06 27.88,25.75 27.75,25.62 27.41,25.28 26.5,25.28 26.41,25.28 26.41,26.88
  pour Top (no thermals): 30.88,26.88 31.81,26.88 32.12,26.56 32.31,26.38 32.31,26.06 32.31,25.75 32.19,25.62 31.84,25.28 30.94,25.28 30.84,25.28 30.84,26.88
  pour Top (no thermals): 35.44,26.88 36.38,26.88 36.69,26.56 36.88,26.38 36.88,26.06 36.88,25.75 36.75,25.62 36.41,25.28 35.5,25.28 35.41,25.28 35.41,26.88
  pour Top (no thermals): 17.44,26.88 18.38,26.88 18.69,26.56 18.88,26.38 18.88,26.06 18.88,25.75 18.75,25.62 18.41,25.28 17.5,25.28 17.41,25.28 17.41,26.88
  pour Top (no thermals): 15.16,37.75 16.72,37.75 16.72,38.44 16.72,38.81 16.59,38.94 16.22,38.94 15.66,38.38 15.16,38.38
  pour Top (no thermals): 13.88,24.25 14.38,24.25 14.75,24.62 14.81,24.69 14.81,25.84 13.12,25.84 13.12,25.03 13.12,24.25
FB1
  Top 0.2: U9.6 41.25,12.5 40.75,12 R29.2
  Top 0.4: R28.1 R29.2
FORCE_BRDCST_+3.3V
  Top 0.2: U11.2 21.09,23.41 21.25,23.25 21.25,22 21.06,21.81 R37.2 12,12.25 12,5.42 J9.3
  Top 0.4: J9.1 18.79,3.29 18.79,2.59 17.46,1.26 15.38,1.26 13.92,2.72 J9.3
FORCE_BRDCST_+5V  (via drill 0.25)
  Top 0.2: U10.2 16.84,23.41 v17,23.25 | v23,23.25 22.92,23.17 U11.4
  Bottom 0.2: v17,23.25 v23,23.25
GND  (via drill 0.13 pad 0, 0.25, 0.25 pad 0)  (4 unrouted)
  Top 0.127: U8.3 48,37.72 | U8.1 48,37.28 U8.9 | U4.3 14,37.31 U4.9 14,37.69 U4.1 | U9.1 43.75,16.2 43.75,16.25
  Top 0.2: U8.3 v48.56,38.06 | v48.56,36.94 U8.1 | U4.3 v13.47,36.97 | v13.47,38.03 U4.1 | v69,41.53 FL3.3 FL3.2 FL3.5 v69.53,40.38 | L5.1 v44.24,32.38 v44.25,32.38 | L6.1 40.88,32.1 v40.88,32.09 | L7.1 v28.44,32.09
  Top 0.3: 34.56,33.12 36.75,33.12 36.75,33 34.38,33 34.38,32.88 36.75,32.88 36.75,32.75 34.38,32.75 34.38,32.62 36.75,32.62 36.75,32.38 | U9.7 41.75,14.25 U9.11 | U9.10 43.25,14.12 v43,14.38 | U6.19 33.75,42.75 34,42.5 | U6.17 34.75,42.25 35,42 | U6.15 34.62,42.62 34.5,42.5 | U6.1 31.88,42.62 31.5,43 36.5,43 | 36.5,43 36.75,43 36.81,42.94 | 36.81,42.94 36.69,42.81 | 36.69,42.81 31.88,42.81 32.06,42.62 U6.15 | U6.15 36.5,42.62 36.81,42.94 | 36.69,42.81 36.75,42.88 37.5,42.88 | 36.5,43 36.56,43.06 37.62,43.06 | U6.5 31.5,40.62 | 31.5,40.62 31.25,40.38 | 31.5,40.62 33.44,40.62 33.19,40.38 31.44,40.38 31.56,40.25 34.5,40.25 34.62,40.12 | 34.62,40.12 34.75,40 U6.9 | U6.7 33.75,40.44 34.5,40.44 | U6.11 35.25,40.62 | 35.25,40.62 35.15,40.53 | 35.15,40.53 35.06,40.44 | 37.06,40.38 35.38,40.38 35.25,40.5 37.56,40.5 37.75,40.31 37.44,40.62 35.25,40.62 | 36.55,34.12 36.41,34.12 36.41,34.62 36.55,34.62 36.69,34.62 36.69,34.22 | U1.2 v10.38,23.41 | 33.41,40.47 arc-90 33.44,40.5 33.5,40.5 | 34.62,40.12 34.75,40.12 35.15,40.53 | 34.5,40.44 35.06,40.44 | 35.06,40.44 35.15,40.53 | 34.62,40.12 34.62,40.31 34.5,40.44 | R29.1 40.75,8.34 40.22,7.81 v39.94,7.81 | PD1.1 v7.53,38 | v7.52,35.72 7.69,36.11 PD1.3
  Top 0.35: L7.1 28.5,32.65 | v26.81,34.5 26.78,34.5 FL2.2 FL2.3 26.28,34.19 26.56,34.19 26.56,34.5 26.62,34.5 v26.19,34.5 26.12,34.5 26.12,34.38 | FL2.5 26.78,32.71 26.38,32.31 v26.81,32.75 27,32.75 27.38,32.38 26.94,32.38 26.81,32.5 | v42.62,34.69 v42.63,34.69 FL1.2 42.2,34.2 | FL1.3 42.2,34.2 | 42.2,34.2 42.5,34.5 | FL1.3 42.13,34.5 42.38,34.75 42.2,34.57 42.2,34.2 | FL1.3 42.13,34.44 41.62,34.94 | FL1.5 42.63,33.19 v42.78,33.03 | 42.12,32.44 42.72,33.03 v42.78,33.03 | v42.78,33.03 43.03,33.03 43.44,32.62 | v42.78,33.03 42.78,32.97 42.5,32.69
  Top 0.4: FL3.3 69,42.25 | L12.1 67.47,39.44 v67.44,39.41 | L11.1 72,42.75
  Top 0.406: v32.19,43.25 31.88,42.94 30.94,42.94
  Top 0.5: v69.53,40.38 69.53,39.56
  other vias: 44.38,13.75 44.38,14.75 44.38,15.75 46.81,15.75 46.81,14.75 46.81,13.75 41.84,20.22 37.88,15.25 37.88,16.25 37.88,14.25 37.88,13.25 37.12,13 36.12,13 37.12,16.5 36.12,16.5 35.38,15.25 35.38,16.25 35.38,14.25 35.38,13.25 30.39,8.06 30.39,9.06 30.39,7.06 27.92,8.03 27.92,9.03 27.92,7.03 41.5,15.12 43,15.12 41.5,14.38 42.25,14.75 27.69,12.38 33.69,26.06 29.34,26.09 24.69,26.06 20.19,26.06 15.69,26.06 14,27.56 6.56,23.56 15.81,21.69 20,21.5 22.88,21.19 28.51,23.47 33.78,21.72 33.38,28.38 31.94,28.38 31.06,29 29.81,18.62 44.56,23 8.81,28.75 5.69,33.88 27.12,45.06 28.19,44 30.38,44 39.69,46 38.62,45 40.75,45 35.81,46.62 44.56,38.72 45.56,38.72 16.44,36.34 17.44,36.34 21.44,36.28 6.75,32.88 42.12,34.69 32.78,42.84 34.25,41.62 33.59,41.62 34.91,41.62 34.25,42.28 33.59,42.28 34.91,42.28 34.91,40.97 34.25,40.97 33.59,40.97 35.72,42.84 36.44,43.12 37.5,43.09 52.69,37.5 43.12,32.53 36.91,32.16 35.56,33.88 35.56,33.25 35.56,34.5 35.56,32.62 36.59,32.62 34.56,32.59 35.06,32.69 36.06,32.66 34.72,35.09 35.28,34.97 35.81,34.97 36.38,35.09 41.12,39.59 37.34,40.44 36.69,40.31 35.78,40.34 32.16,40.25 32.78,40.44 29.31,40.19 23.31,38.97 34.16,32.22 27.19,32.34 26.59,32.31 25,31.75 13.78,21.78 2,44 2,42 2,40 4.72,35.28 51.19,39.06 51.09,35.94 36,38.81 36,37.06 37.84,37.41 2,34 2,32 2,30 2,28 2,26 2,24 2,22 2,20 2,18 2,16 2,14 2,12 2,10 2,8 8,2 10,2 22.25,2 44,2 54,8 54,10 54,12 54,14 54,16 54,18 54,20 54,22 54,24 54,26 54,28 54,30 54,32 54,34 54,40 54,42 54,44 44,50 42,50 40,50 38,50 36,50 28,50 26,50 24,50 22,50 20,50 18,50 16,50 14,50 10,50 12,50 8,50 30,50 32,50 34,50 12,2 20.94,2 46,50 48,50 54,38 54,36 46,2 48,2 2,36 2,38 33.75,39.59 34.75,39.59 35.25,39.59 34.75,43.66 33.75,43.66 34.53,34.62 36.53,34.62 36.53,34.16 36.53,33.09 34.56,33.09 26.25,33.94 26.75,33.94 26.78,33.31 42.62,33.59 42.62,34.22 42.12,34.22 7.69,36.19 8.75,36.84 7.69,37.5 26.25,2.5 27.25,2.5 26.75,5 26.25,4.5 27.25,4.5 26.75,2 23.72,2.5 24.72,2.5 24.22,5 23.72,4.5 24.72,4.5 24.22,2 49.81,38.81 52.44,38.81 52.44,36.19 49.81,36.19 69.5,41.53 69.5,40.94 69.19,42.25 63.34,42.41 60.72,42.38 63.34,39.53 60.69,39.53 62,42.53 60.53,41 62,39.41 75.62,39.69 77.19,41.28 75.56,42.81 66.84,36.34 64.22,36.44 66.84,33.72 64.19,33.59 65.5,36.59 64,35.06 65.5,33.47 74.25,42.69 76.91,42.69 76.88,39.81 74.25,39.81 71.56,33.47 73.03,35.09 71.56,36.59 70.19,36.34 72.84,36.47 72.81,33.59 70.19,33.72 67.16,30.31 64.53,30.41 67.16,27.69 64.5,27.56 65.81,30.56 64.38,29.03 65.81,27.44 71.22,27.41 72.72,29 71.22,30.56 69.91,30.31 72.56,30.44 72.53,27.56 69.91,27.69 69.81,24.31 67.19,24.41 69.81,21.56 67.16,21.56 68.47,24.56 66.94,23 68.47,21.44 69.81,18.31 67.19,18.41 69.81,15.69 67.16,15.56 68.47,18.56 67.03,17.03 68.47,15.44 60.62,8.03 60.62,14.03 60.62,16.03 60.62,18.03 60.62,20.03 60.62,22.03 60.62,24.03 60.62,26.03 60.62,28.03 60.62,30.03 60.62,32.03 60.62,34.03 60.62,44.03 60.62,38.03 60.62,36.03 66,2 76.56,8 76.56,10 76.56,12 76.56,14 76.56,16 76.56,18 76.56,20 76.56,22 76.56,24 76.56,26 76.56,28 76.56,30 76.56,32 76.56,34 76.56,44 76.56,38 76.56,36 66,50 71,50 68.5,50 71,2 68.5,2 7.25,10 10,5 5,10 5.25,15.75 7.25,15 10,20 5,20 15,20 12.25,15 12.75,10 17.25,10 18.75,20.5 25.19,18.62 32.25,21.25 21.59,3.34 33.94,18.59 38,26 38.12,27.75 38.5,29.5 36.94,29.03 25,30 20,30 15,30 5,30 5,25 34,10 34.09,7.88 45,5 52.16,9.91 52.16,14 52.12,17.94 52.06,21.94 48.44,22.12 53.03,26.72 49.28,29.97 52.03,33.97 38.91,31.12 51.81,41.97 45,45 46.66,47.47 48.41,43.72 25,45 23.47,47.31 15.32,46.03 8,43 10,40 5.12,40.62 35.66,23.38 37.23,23.41 26,23.19 40.75,23.75 40.25,22.75 20.96,44.98 20.56,44.02 20,45.91 3.38,38.16 6.05,38.16 6.04,35.51 3.39,35.5 20.44,38.69 18.44,38.69 16.88,18.44 14.28,16.09 43.56,36.28 41.56,36.28 40.53,38.72 5,43 10,43 12.88,22.47 14.66,22.47 4.75,38.38 3.12,36.88 19.5,43.19 21,43.19 22.5,43.19 24,43.19 25.5,43.19 27,43.19 28.5,43.03 30,43.03 31.5,43.03 39,43.03 40.5,43.03 42,43.19 43.5,43.19 45,43.19 46.38,42.88 47.62,42.31 48.59,41.41 49.19,40.25 49.38,39.62 17.06,43 15.59,42.78 14.31,42.12 13.34,41.06 12.78,39.81 12.62,38.88 12,38.88 10.5,38.88 9,38.88 15.47,39.06 16.5,40.12 18,40.09 19.5,40.06 21,40.06 22.5,40.12 24.16,40.12 27,40.09 27.75,40.12 30.38,40.22 31.5,40.47 38.81,40.25 40.28,40.25 42,40.12 43.5,40.12 45,40.09 46.06,39.97 46.56,39.34 12.66,36.16 12.91,34.75 13.47,33.66 14.41,32.72 15.66,32.12 17.16,31.94 18.66,31.94 20.16,31.94 21.66,31.94 23.16,31.94 24.34,31.94 30,32.16 31.5,32.16 37.5,32.16 39,32.16 40.19,32.25 41.62,32.25 45,32.53 46.47,32.62 47.81,33.25 48.78,34.28 49.31,35.47 16.5,34.78 15.53,35.59 18,34.72 19.5,34.72 21,34.72 22.5,34.72 24,34.72 25.5,34.72 27.25,34.94 28.5,35.03 30,35.09 31.5,35.09 32.97,35 37.5,35.09 39,35.12 40.5,35.03 41.69,35 43.5,35.28 45,35.28 46.34,35.59 9.94,32.69 9.94,31.5 9.94,30 13.06,30 13.06,31.5 13.06,33 13,28.5 12.84,27.25 10.09,27.53 10.09,26.03 9.84,24.53 45.69,16.03 45.69,13.47 29.81,9.75 28.84,9.75 28.56,38.97 23,28.5 22.03,19.5 41.25,29.5 44.25,30.25 52.5,31 28.03,18.69 24.34,36.16 27.34,36.19 64.19,42.34 65.62,42.34 67.12,42.34 68.62,42.34 70.09,42.59 71.34,42.62 72.69,42.62 64.22,39.59 65.72,39.59 66.69,39.59 68.28,39.59 70.5,39.88 72,39.88 73.34,39.88 67.78,36.44 69.28,36.44 67.81,33.66 69.31,33.66 68.03,30.38 69,30.38 68.06,27.62 69,27.62 70.75,24.53 72.28,24.56 70.78,21.5 72.28,21.44 73.09,22.06 73.09,23.97 74.25,23 64.53,12.56 66.06,12.59 64.56,9.53 66.06,9.47 66.88,10.09 66.88,12 68.03,11.03 70.75,18.53 72.28,18.56 70.78,15.5 72.28,15.44 73.09,16.06 73.09,17.97 74.25,17 17,14.38 19.5,49 13,48 14.5,45 49.5,32.25 29.84,6.25 28.84,6.25 20,10 25,10 25,14.75 30,14.75 20,15 35,20 10.19,46.94 18.34,46.78 45.62,21.31 44.12,27.78 48.16,30.34 44.19,25.78 72.22,11.19 63.59,16.38 64.47,22.31 74.53,28.59 74.88,34.94 62.5,34.94 62.69,31.66 68.25,6.03 63.59,25.78 74.5,37.56 62.5,37.38 68.53,46.19
  pour Route2 (isolate 0.381, no thermals): 0,51.95 78.58,51.95 78.58,0 0,0
  pour Bottom (isolate 0.381, rank 2, no thermals): 0,52 78.5,52 78.5,0 0,0
  pour Top (isolate 0.381, rank 5, no thermals): 0,0 0,52 73.38,52 78.5,52 78.5,0.88 78.5,0
N$1
  Top 0.15: 7.5,36.84 PD1.2
  Top 0.4: 7.1,36.84 7.5,36.84
  Top 0.711: J1.1 7.1,36.84
N$2
  Top 0.2: 14,38.53 U4.8
  Top 0.33: R1.2 arc90 R1.2 | 19.9,41.62 arc90 R3.1
  Top 0.711: 14,38.53 arc-90 17.09,41.62 R1.2 19.9,41.62
N$3
  Top 0.2: U1.5 14.41,23.41 15.5,24.5 15.68,24.5 U10.1
N$4
  Top 0.7: R1.1 18.26,44.98 R2.2
N$5
  Top 0.127: PD1.4 8.93,36.19
  Top 0.4: 8.93,36.19 9.31,36.19 | R39.1 10.63,36.14 10.68,36.19
  Top 0.711: 9.31,36.19 10.68,36.19 arc-90 11.5,35.38 11.5,33.9 R5.2 11.47,32.22 R7.1
N$6
  Top 0.5: 11.47,26.88 C1.1
  Top 0.711: R7.2 11.5,28.77 R8.1 11.47,26.88
N$7
  Top 0.6: R6.2 R5.1
N$8
  Top 0.3: U1.1 11.48,24.55
  Top 0.5: C1.2 11.48,25.55
  Top 0.711: 11.48,25.55 11.48,24.55
N$9
  Top 0.3: R10.2 R9.1 9.44,22.59 C2.1 9.44,22.46 U1.3
N$10  (via drill 0.25)
  Top 0.2: U2.1 24.36,24.36 24,24 v24,23.75 | U3.1 28.48,24.36 v28.47,24.34 | v23.99,23.75 v24,23.75 | S1.2 18.16,17.12 24,17.12 | 24,17.12 LED1.2 | v24,23.75 24,17.12
  Route15 0.2: v28.47,24.34 27.88,23.75 v23.99,23.75
N$11
  Top 0.4: U2.3 24.98,21.46 25.19,21.25 R11.2
N$12
  Top 0.2: S1.3 10.71,14.75 S1.5
N$13
  Top 0.127: U4.6 16.94,37.5 C12.1 17.44,38.44 18.13,39.13 20.87,39.13 21.44,38.56 R14.1
  Top 0.4: R13.2 R14.1
N$14
  Top 0.4: R12.2 29.62,21.25 29.44,21.44 29.44,22.41 U3.3
N$15
  Top 0.2: LED1.1 27,17.38 R32.2
N$16
  Top 0.3: R20.1 42.88,45 41.88,44 35.58,44 U6.16
N$17
  Top 0.127: C11.1 18.44,36.44 17.9,35.9 16.1,35.9 15.75,36.25 15,36.25 14.78,36.47 14.78,36.94 14.62,37.1 U4.5
  Top 0.4: R16.1 R15.2 C11.1
N$18  (via drill 0.25)
  Top 0.2: v36.38,21.75 U5.4 | v19.44,38.69 R15.1
  Bottom 0.2: v36.38,21.75 35.5,21.75 28.25,29 | 28.25,29 | 28.25,29 23.75,29 20.75,32 20.75,34.25 19.44,35.56 v19.44,38.69
N$19
  pour Top (no thermals): 35.19,45.69 34.3,45.69 34.2,45.59 34.14,45.53 34.14,43.39 34.36,43.39 34.36,44 34.36,44.03 34.69,44.36 35.19,44.86
N$20
  pour Top (no thermals): 32,45 32,45.45 33.06,45.45 33.36,45.45 33.36,43.38 33.14,43.38 32,44.52
N$21
  Top 0.7: L2.2 32.27,46.73 C19.1 C15.1
  Top 0.8: R20.2 C17.1 C16.1 37.77,47.73 37.48,48.02 L1.2 32.57,48.02 R17.1 32.3,48.29 L2.2
N$22  (1 unrouted)
  Top 0.2: R19.2 C18.1 | 34.05,38.15 C18.1 | C18.1
  Top 0.3: C18.1 U6.8
N$23
  Top 0.4: C37.1 42.17,21.92 41.54,21.29 R30.1
N$24
  Top 0.2: 36.5,41.62 U6.13_14_15 | 38.87,41.63 L3.1
  Top 0.33: L3.1 arc-90 L3.1
  Top 0.711: 36.5,41.62 36.5,41.63 C21.1 38.87,41.63
N$25
  Top 0.2: 29.5,41.62 R18.1 arc90 R18.1
  Top 0.33: C22.1 arc-90 C22.1
  Top 0.711: C24.2 C22.1 | C22.1 29.5,41.62 arc90 29.5,41.62
N$26  (1 unrouted)
  Top 0.152: 37.34,33.62 | 37.88,33.62 | 37.88,33.62 C26.2
  Top 0.3: U7.2 37.34,33.62
  Top 0.33: C26.2 arc90 C26.2
  Top 0.711: 37.34,33.62 37.88,33.62
N$27
  Top 0.2: 40.25,41.62 L3.2
  Top 0.711: 40.25,41.62 C23.1 C20.1
N$28
  Top 0.2: C28.1 31.38,33.62 | L4.1 33.78,33.62 | U7.7
  Top 0.3: U7.7 33.78,33.62
  Top 0.711: 31.38,33.62 33.78,33.62
N$29
  Top 0.3: R23.1 C29.1 32.92,31.4 32.92,32.12 L4.2
  Top 0.4: C27.2 32.27,30.75 C29.1
N$30
  Top 0.127: U7.6 34.25,34.12 33.97,34.41 33.97,36.22
  Top 0.152: 33.97,36.22 R22.2 R21.1
N$31
  Top 0.2: U8.2 48.97,37.5
  Top 0.711: 48.97,37.5 J2.1
N$32
  Top 0.127: U8.6 45.06,37.5 C33.1 44.56,36.31 44.09,35.84 41.16,35.84 40.75,36.25 | R25.1 40.56,36.44 40.75,36.25 | 40.75,36.25
  Top 0.4: R24.2 R25.1
N$33
  Top 0.2: C26.1 39.62,33.62 | FL1.4 42,33.62
  Top 0.4: L6.2 41.04,33.62 41.5,33.62
  Top 0.42: 42,33.62 41.5,33.62
  Top 0.711: 39.62,33.62 41.5,33.62
N$34
  Top 0.127: C32.1 43.56,38.56 44.16,39.16 45.84,39.16 46.25,38.75 46.38,38.62 47.09,38.62 47.22,38.5 47.22,38.03 47.35,37.9 U8.5
  Top 0.4: R27.1 R26.2 C32.1
N$35
  Top 0.152: FL2.1 27.72,33.62 arc90 27.72,33.62
  Top 0.2: 29.75,33.62 C28.2 arc-90 C28.2
  Top 0.3: L7.2 28.29,33.62 27.72,33.62
  Top 0.33: C28.2 arc90 C28.2
  Top 0.711: 27.72,33.62 29.75,33.62
N$36  (via drill 0.25)
  other vias: 31.31,2.47 32.31,2.47 31.81,5 31.31,4.5 32.38,4.5 31.81,1.97 28.78,2.44 29.78,2.44 29.28,5 28.78,4.5 29.78,4.5 29.28,1.94
  pour Bottom (isolate 0.2, no thermals): 33.08,4.91 32.58,5.41 28.7,5.41 28.2,4.91 28.2,1.41 32.08,1.41 33.08,2.41
  pour Top (isolate 0.2, no thermals): 28.7,5.41 28.2,4.91 28.2,1.41 32.08,1.41 33.08,2.41 33.08,8.97 33.08,9.16 32.76,9.47 31.2,9.47 31.08,9.35 31.08,6.28 30.08,5.41
N$37
  cutout Route2: 59.03,51.86 59.03,-0.35 55.52,-0.35 55.52,51.86
N$38
  cutout Route15: 59.03,51.86 59.03,-0.35 55.52,-0.35 55.52,51.86
N$41  (2 unrouted)
  Top 0.2: FL3.4 68.83,40.97
  Top 0.4: R35.1 66.2,40.97 | L12.2 68.2,40.81 68.36,40.97
  Top 0.43: 68.83,40.97 68.36,40.97
  Top 0.711: 66.2,40.97 68.36,40.97
N$46  (1 unrouted)
  Top 0.2: FL3.1 70.44,41.25
  Top 0.3: L11.2 71.85,41.25 70.44,41.25
  Top 0.711: 70.44,41.25 J4.1
N$47
  Top 0.711: J6.1 J7.1
N$48
  Top 0.711: J8.1 R33.2
N$49
  Top 0.711: CF1.CENTER R34.2
N$50
  Top 0.2: 64.7,40.97 R35.2
  Top 0.711: J5.1 64.7,40.97
N$51
  Top 0.2: LED2.1 31.75,17.38 R36.2
N$52
  Top 0.2: S1.4 15.79,19.84 U10.4
N$53
  Top 0.5: 67.83,35.03 C42.1
  Top 0.711: J10.1 67.83,35.03
N$54
  Top 0.711: J11.1 C42.2
N$55
  Top 0.711: J12.1 R38.2
N$56
  Top 0.2: R18.2 30.87,41.63 30.88,41.62 | 32.12,41.62 U6.1_2_3
  Top 0.711: 30.88,41.62 32.12,41.62
PA_MATCH_OUT
  Top 0.2: U8.4 48,38.53
  Top 0.711: 48,38.53 48,38.91 arc90 45.28,41.62 C20.2 | C20.2 arc-90 C20.2
PA_ON_LNA_OFF  (via drill 0.25)
  Top 0.2: U2.6 28.75,25.84 v28.75,30.5 | 31,37.92 v31,37 31.56,36.44 R21.2 | 31,37.92 R19.1 | U6.6 31.57,39.58 31,39 31,37.92
  Bottom 0.2: v28.75,30.5 29.25,31 29.25,35.25 v31,37
PA_PAD_OUT
  Top 0.33: R4.1 arc90 R4.1 | C24.1 arc-90 C24.1
  Top 0.711: R3.2 R4.1 | R4.1 C24.1
POST_LNA_FILTER_OUT  (1 unrouted)
  Top 0.152: 14,36.46 U4.4 arc-90 U4.4
  Top 0.2: FL2.4 26.12,33.34
  Top 0.3: L8.2 25.18,33.34 25.7,33.34
  Top 0.33: L8.2 arc-90 L8.2 | FL2.4 arc90 FL2.4
  Top 0.42: 26.12,33.34 25.7,33.34
  Top 0.711: 14,36.46 14,36.25 arc90 16.92,33.33 25.7,33.34
PWR_DIV_OUT2  (1 unrouted)
  Top 0.152: 10.16,37.5 R39.2
  Top 0.2: U4.2 13.03,37.5 | 9.3,37.5 9.18,37.5 | 8.89,37.5 PD1.6
  Top 0.4: 9.18,37.5 8.89,37.5
  Top 0.711: 13.03,37.5 10.41,37.5 | 9.3,37.5 10.25,37.5 10.38,37.5 10.41,37.5 | 10.41,37.5 10.16,37.5
RX_IN
  Top 0.2: 43.56,33.91 FL1.1 arc-90 FL1.1 | 48,36.33 U8.8 | L5.2 44.09,33.91 44,33.91
  Top 0.711: 48,36.47 48,36.33 arc-90 45.58,33.91 44,33.91 43.56,33.91
SHDN1  (via drill 0.25)
  Top 0.127: U9.4 41.75,16.62
  Top 0.2: R31.1 v41.75,10.25 | 41.75,16.62 41.49,16.89 40.81,16.89 40.55,16.63 v40.55,16.56
  Bottom 0.2: J3.1 42,10 v41.75,10.25 40,12 40,16.01 v40.55,16.56
SWA1
  pour Top (isolate 0.2, rank 2, no thermals): 42.63,15.81 42.63,17.62 41.95,18.29 41.31,18.29 41.31,19.16 41.97,19.16 42.44,19.62 42.75,19.94 42.75,20.44 43.78,20.44 43.78,17.06 43.31,17.06 42.94,16.69 42.94,15.81
SWB1
  pour Top (no thermals): 46.03,11.5 46.03,10.38 45.94,10.28 45.88,10.22 43.09,10.22 42.5,10.22 42.03,10.69 41.47,10.69 41.34,10.69 41.22,10.81 41.22,11.69 41.31,11.78 41.84,11.78 42.28,12.22 42.62,12.56 42.62,13.09 42.62,13.69 42.81,13.69 42.88,13.69 42.88,13.03 42.88,12.81 43.16,12.53 43.47,12.22 44.31,12.22 45.84,12.22 45.97,12.09 46.03,12.03
TX_RX_CTL  (via drill 0.25)
  Top 0.2: U3.6 32.39,24.36 33.34,23.41 U5.2 34.47,23.41 v35.16,24.09 | v42.56,36.28 R26.1
  Bottom 0.2: v35.16,24.09 36.64,25.58 36.76,25.58 39.52,28.34 39.52,32.26 39.75,32.49 39.75,35.5 40,35.75 42.03,35.75 v42.56,36.28
VC1  (via drill 0.25)
  Top 0.2: U9.5 40.88,16.2 40.62,15.94 v40.62,15.56 | C38.1 39.75,20.25 40.01,20.51
  Top 0.4: 39.75,20.25 v39,20.25 | R30.2 40.01,20.51
  Bottom 0.2: v39,20.25 40.31,18.94 | 40.31,18.94 | v40.62,15.56 41.25,16.19 41.25,18 40.31,18.94
VIN1  (via drill 0.25, 0.25 pad 0)
  Top 0.35: U9.8 42.25,12.75 v41.88,12.38
  Bottom 0.4: v41.88,12.38 44.34,9.91 L10.2
  other vias: 38.97,4.5 39.94,4.5 39.47,5 39.47,2 38.97,2.5 39.94,2.5 44.34,9.13
  pour Top (rank 2, no thermals): 45.5,20 45.25,20 45.25,17.97 45.25,17 45.56,16.69 46.84,16.69 47.16,16.38 47.53,16 47.53,13.91 47.53,13.31 47.09,12.88 46.41,12.19 46.41,10.28 46.03,9.91 45.88,9.91 42.78,9.91 42.69,9.81 42.69,9.19 42.47,8.97 42.25,8.75 41.66,8.75 41.44,8.75 41.44,8.44 40.44,7.44 38.34,5.34 38.34,4.41 38.34,1.69 38.72,1.31 40.16,1.31 40.44,1.59 40.62,1.78 40.62,4.59 40.62,4.81 41.72,5.91 47.03,5.91 49.25,8.12 50.62,9.5 50.62,15.84 50.62,19.38 49.59,20.41 46.09,20.41
VOUT1  (via drill 0.25 pad 0)
  Top 0.4: R28.2 38.5,8.75
  other vias: 36.91,5 36.44,4.5 37.38,4.5 36.44,2.5 37.41,2.5 36.94,2
  pour Top (isolate 0.2, no thermals): 39.75,10.75 40.25,11 40.25,16.12 40.12,16.25 40.12,16.88 40.25,17 41.75,17 42,16.75 42.09,16.66 42.09,15.84 42.38,15.84 42.38,17.41 41.75,18.03 41.13,18.03 40,19.25 38.5,19.25 38.5,18.25 38.5,10.75
  pour Top (isolate 0.2, no thermals): 39,13 38.5,13 38,12.5 35.75,12.5 35,11.75 35,5.94 35.62,5.31 35.62,1.69 36,1.31 37.69,1.31 38,1.62 38.06,1.69 38.06,6.56 38.06,6.88 38.69,7.5 39.19,8 39.19,8.81 39.19,10.19 39.38,10.38 39.94,10.38 40.19,10.62 40.25,10.69 40.25,11.88 39.12,13

### Text on the board
tPlace: ORESAT DxWiFi / PA/LNA BOARD REV.1 | OLIVER JONES / OLIVER REW / 2018-09-07 | 2.4GHz WiFi BPF | ANT | HOST | COUPLING CAP | THROUGH | GND | GND | 5V EXT | 5V EXT | 5V PWR | 5V OUT | VBAT | !DISABLE | TESTS | 8 | 7 | 6 | 5 | 4 | 3 | 2 | 1 | HF RESISTOR | POWER HEADER | STD RESISTOR | TX | PWR | TX | RX | STUB | AUTO | FORCE TX | 3 | 2 | 1 | 8 | 7 | 6 | 5 | 4 | 3 | 2 | 1